# Altium project TL3572-EVM-A1.1-000-SCH-202609041404.PrjPcb (part 1 of 6)
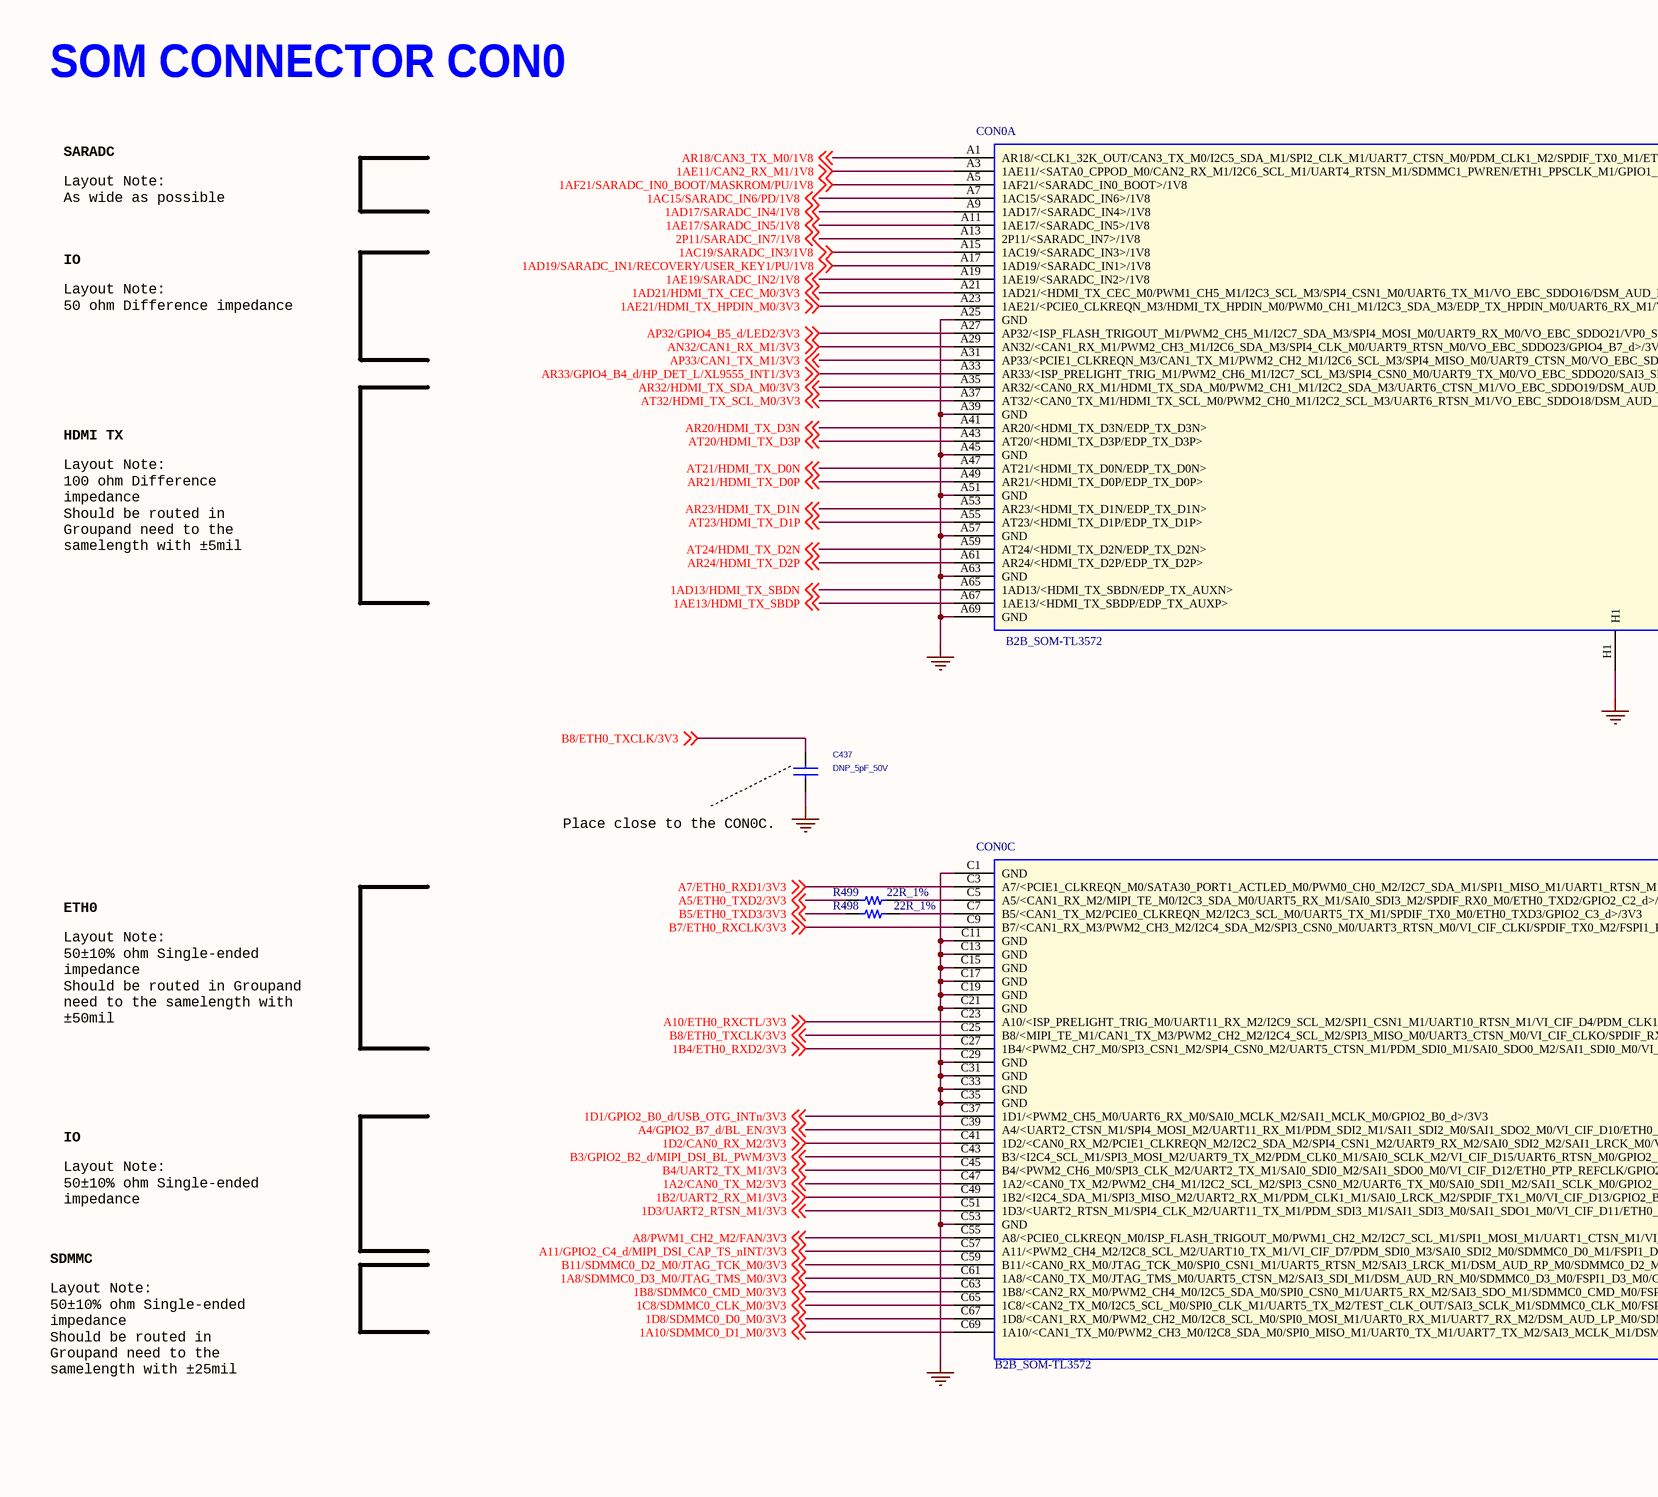
[diagram p0: P03_SOM CONNECTOR CON0.SchDoc, top left]
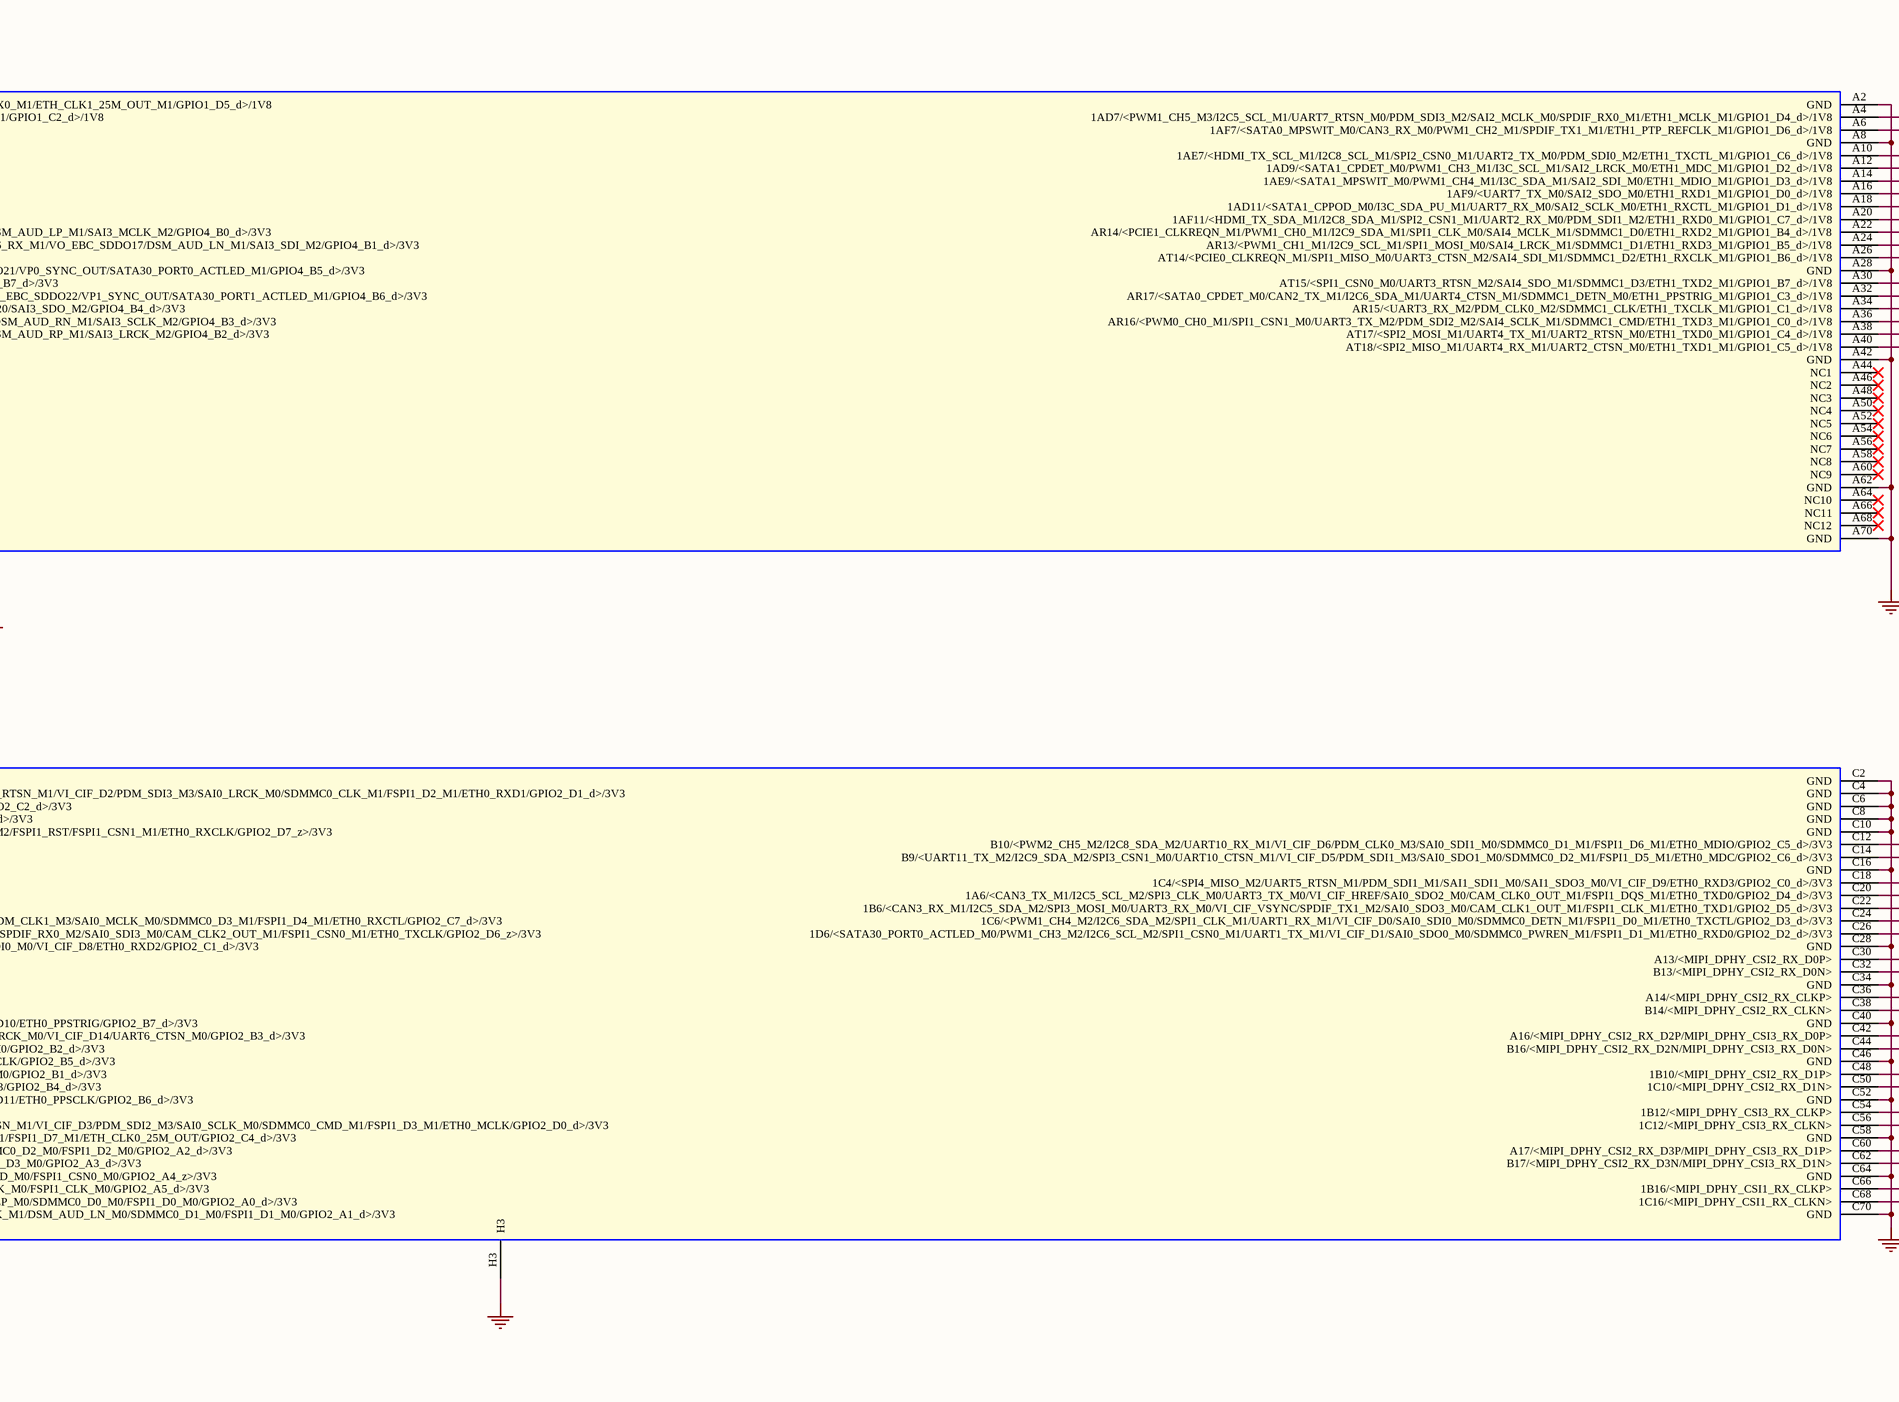
[diagram p1: P03_SOM CONNECTOR CON0.SchDoc, top middle]
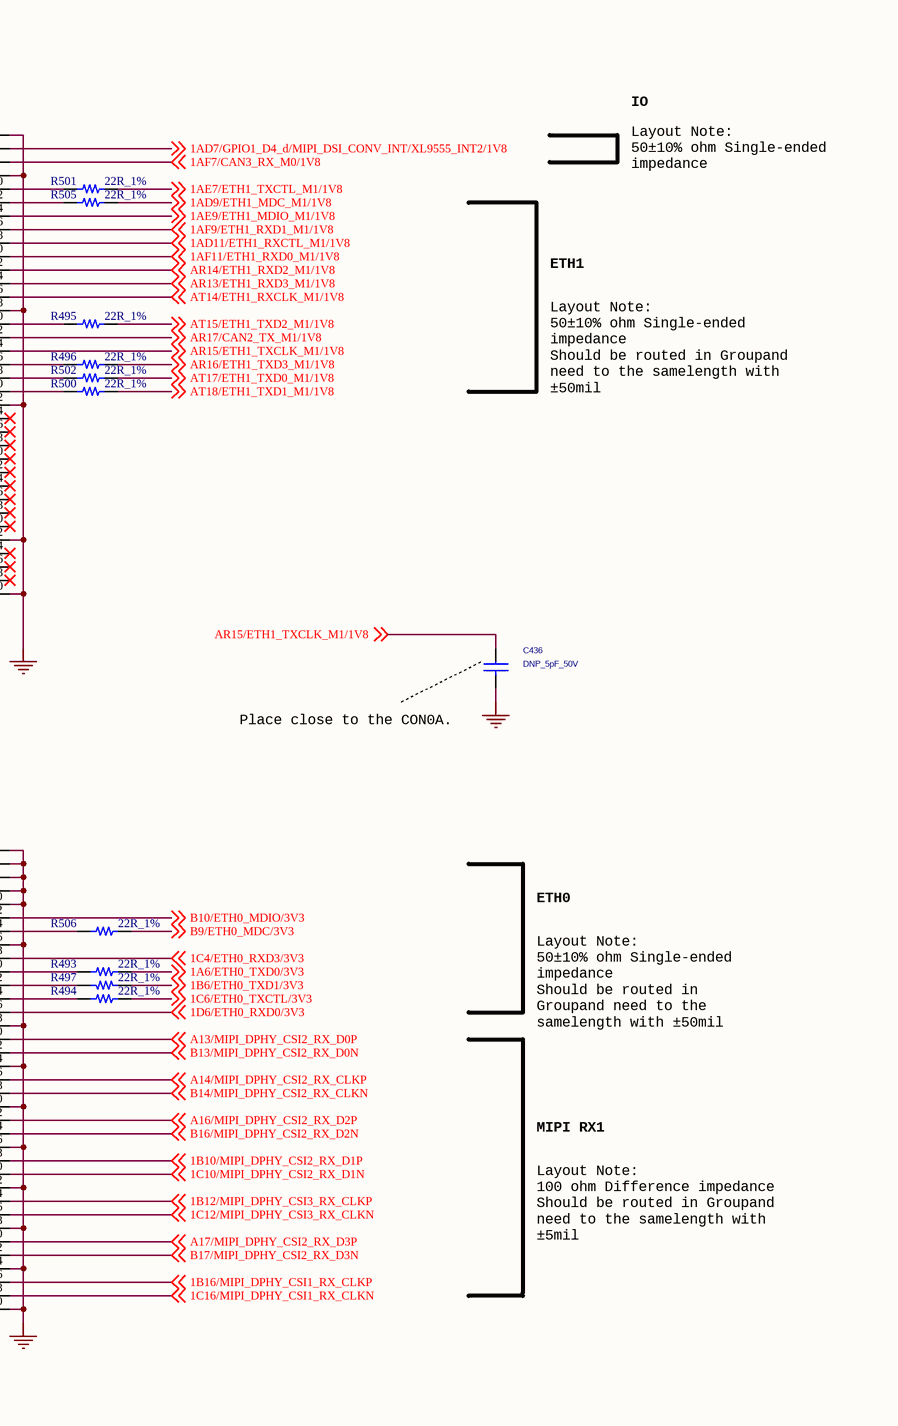
[diagram p2: P03_SOM CONNECTOR CON0.SchDoc, top right]
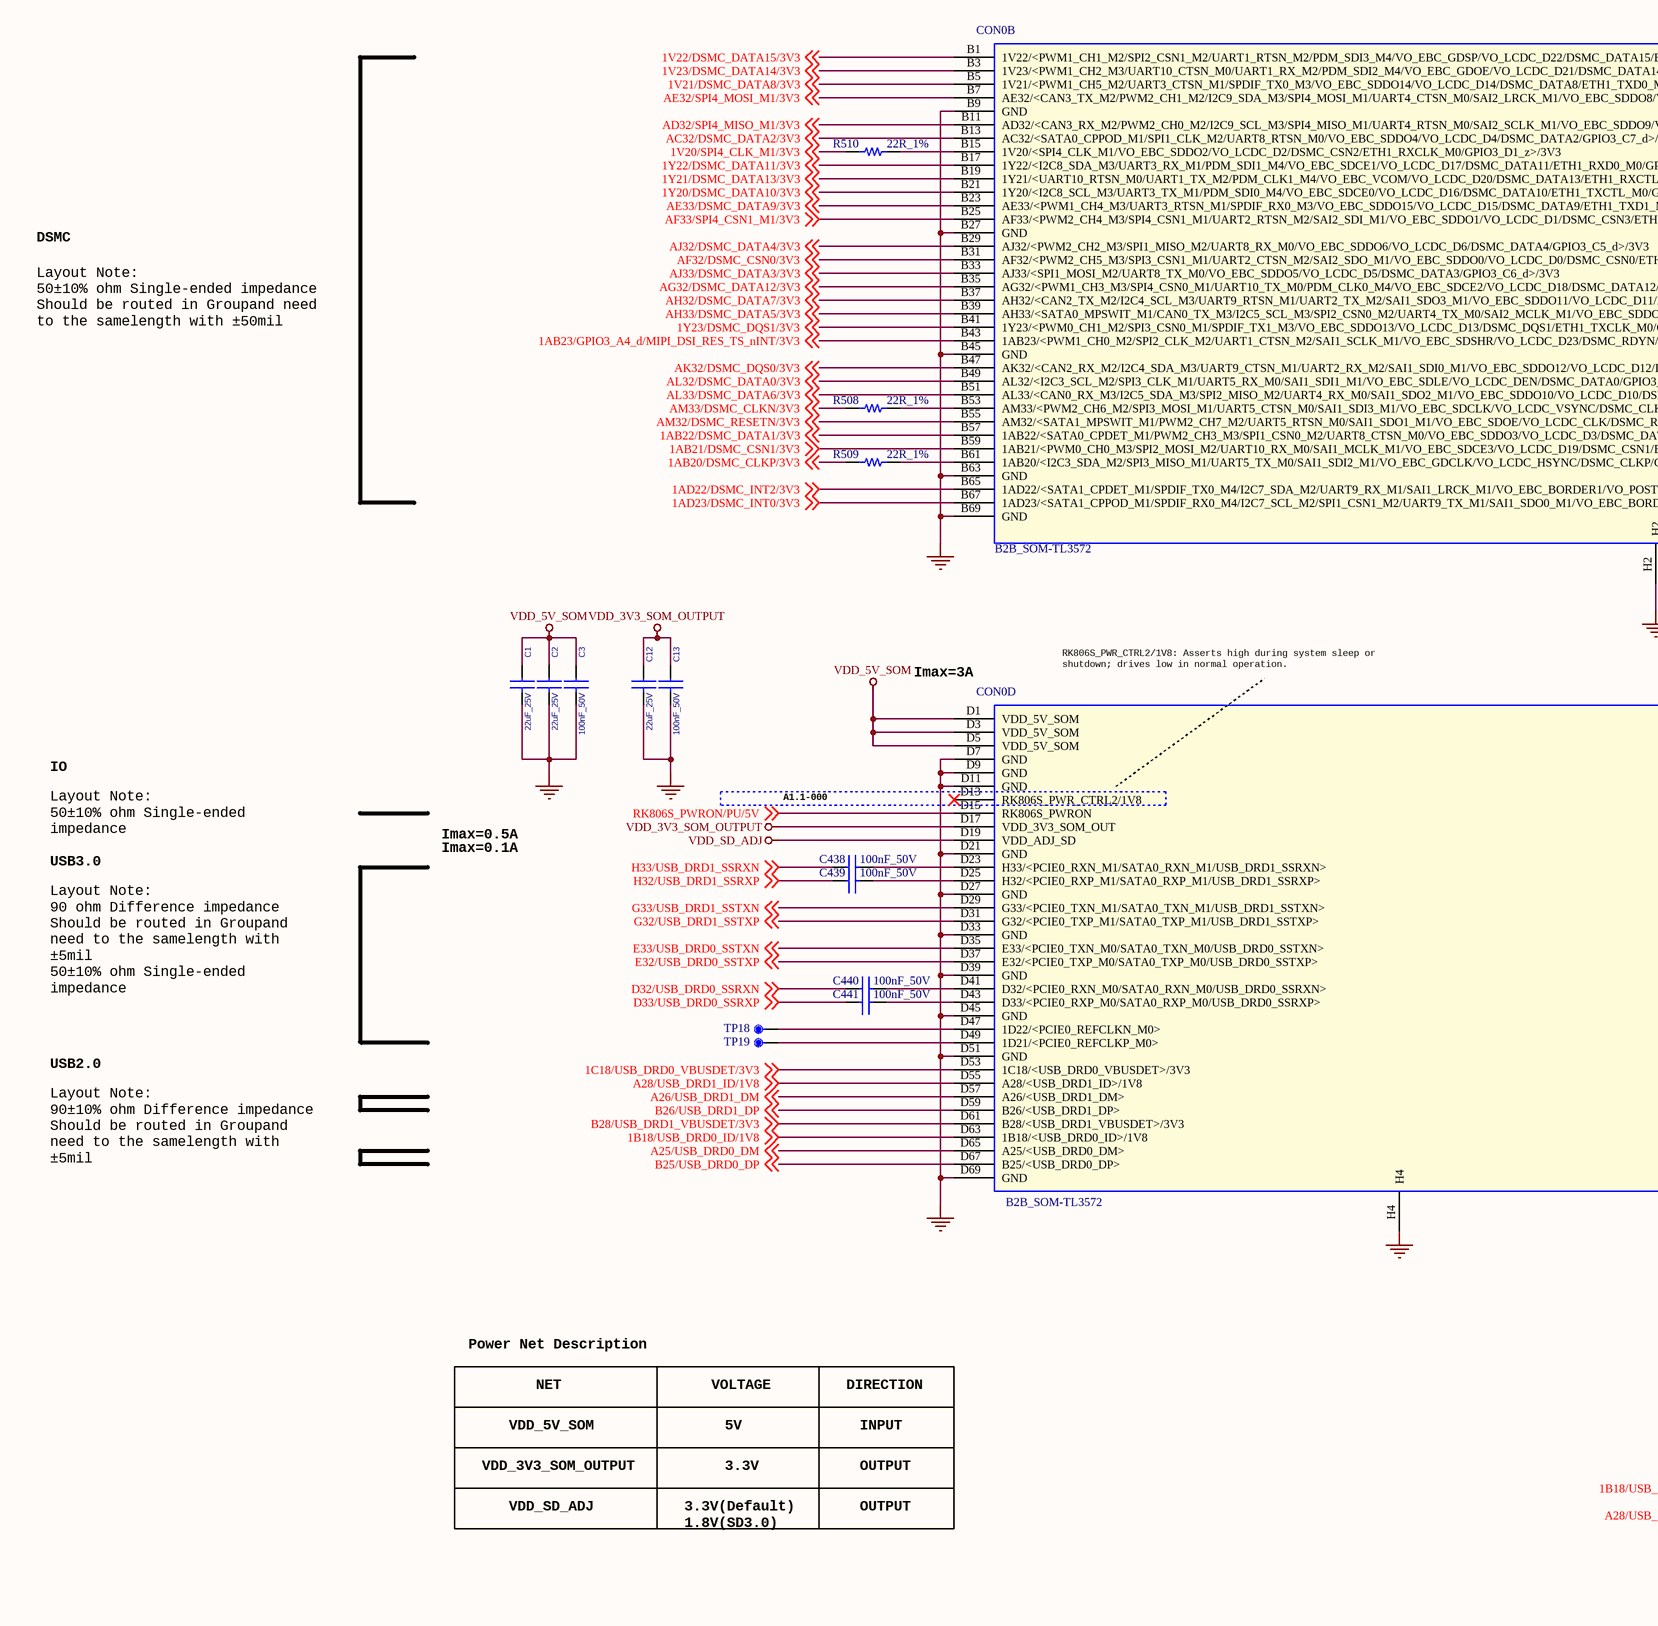
[diagram p3: P03_SOM CONNECTOR CON0.SchDoc, bottom left]
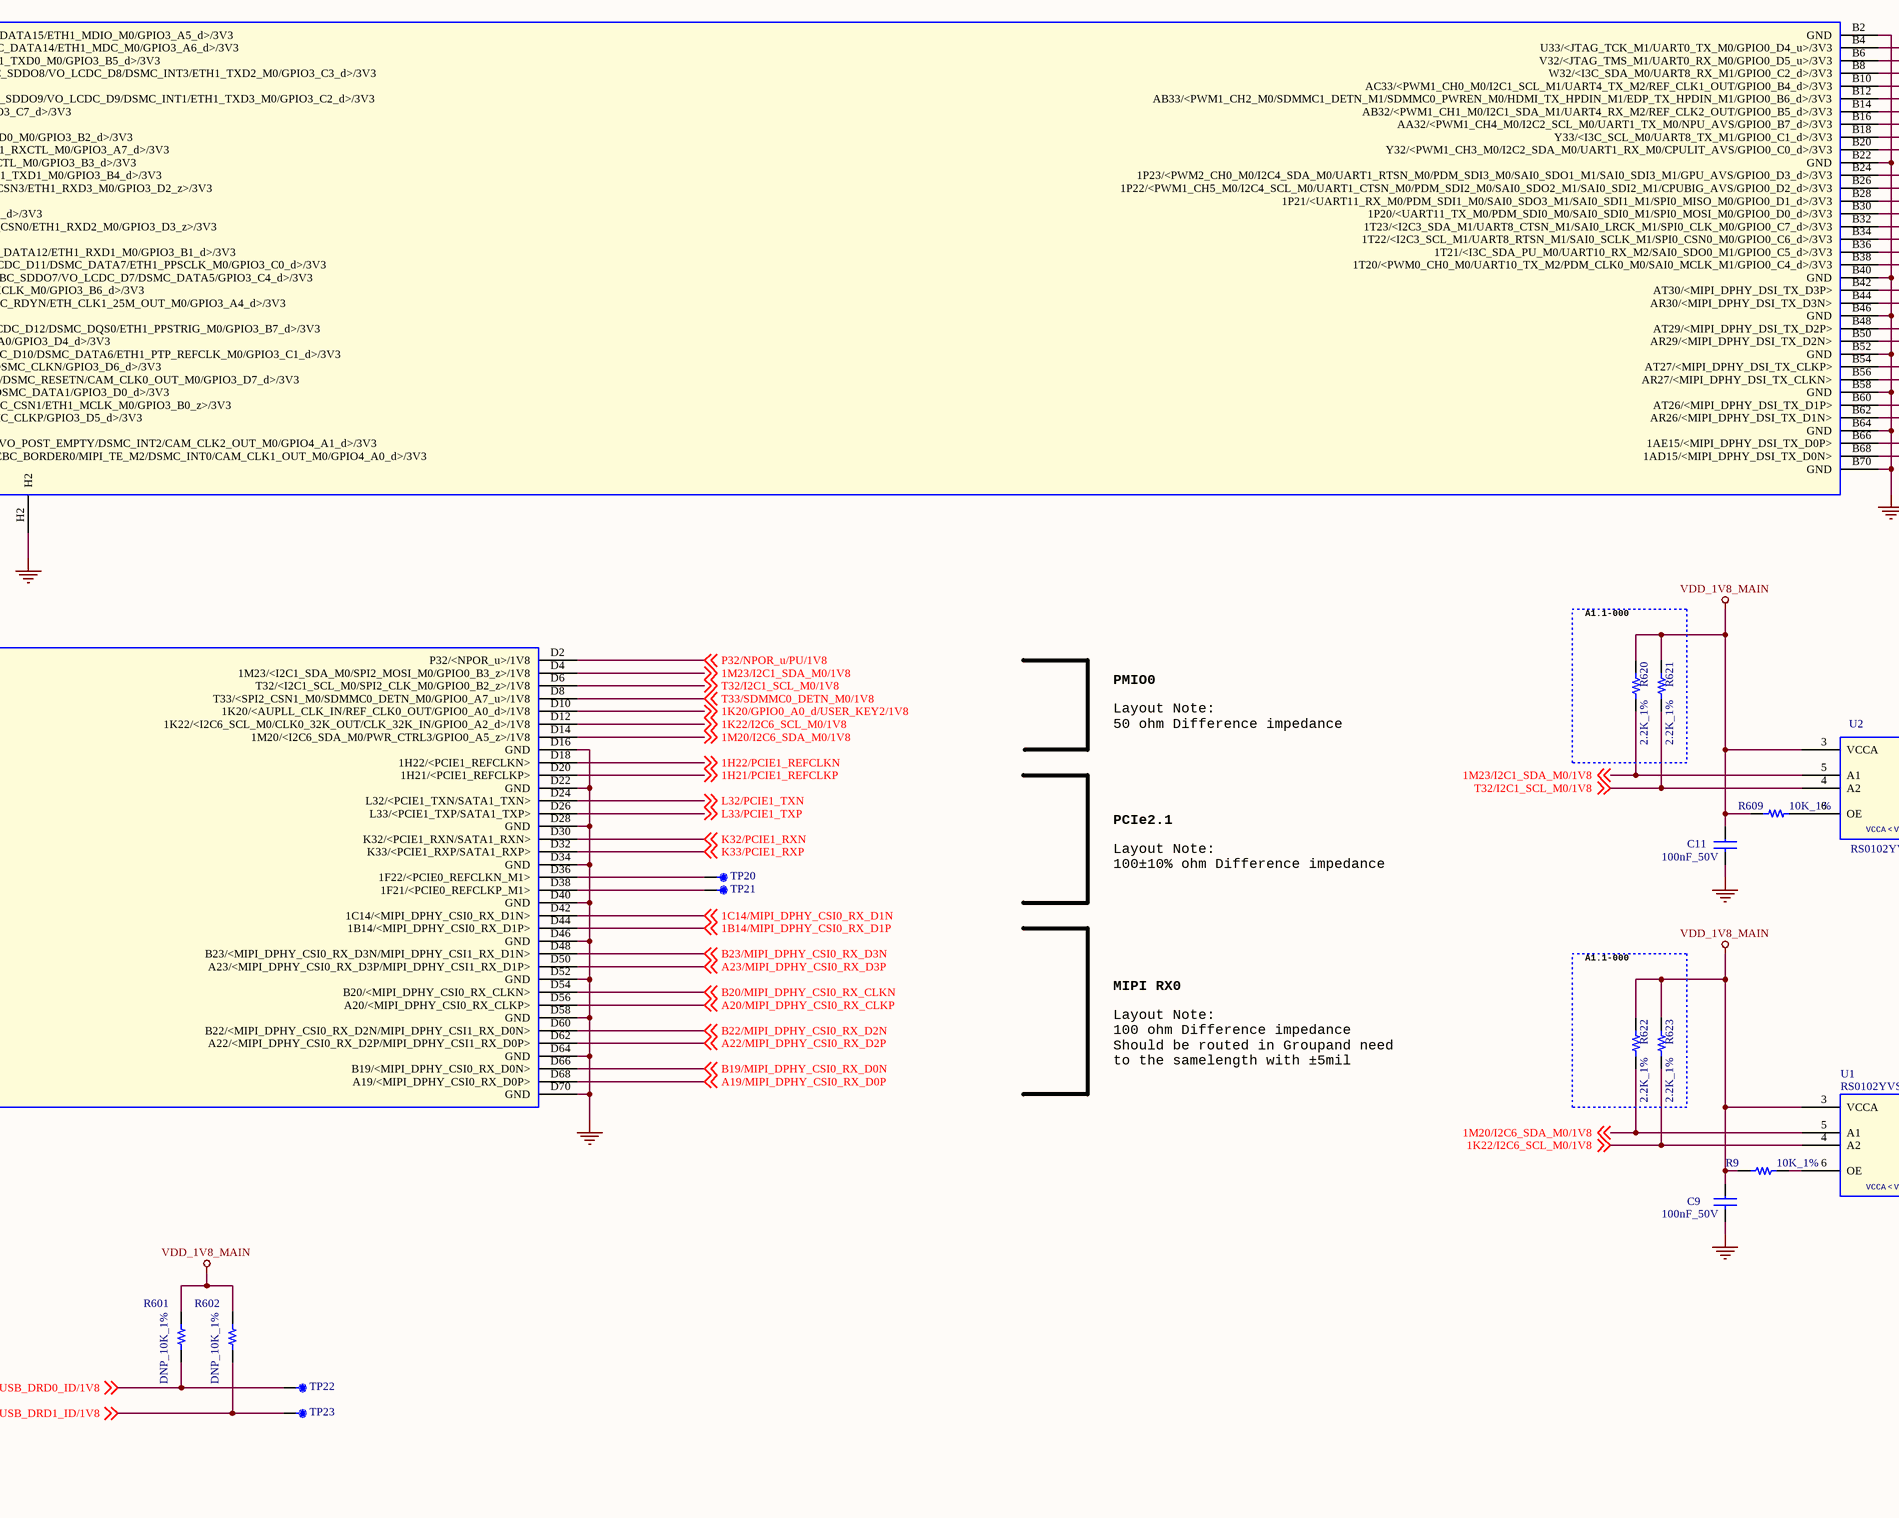
[diagram p4: P03_SOM CONNECTOR CON0.SchDoc, bottom middle]
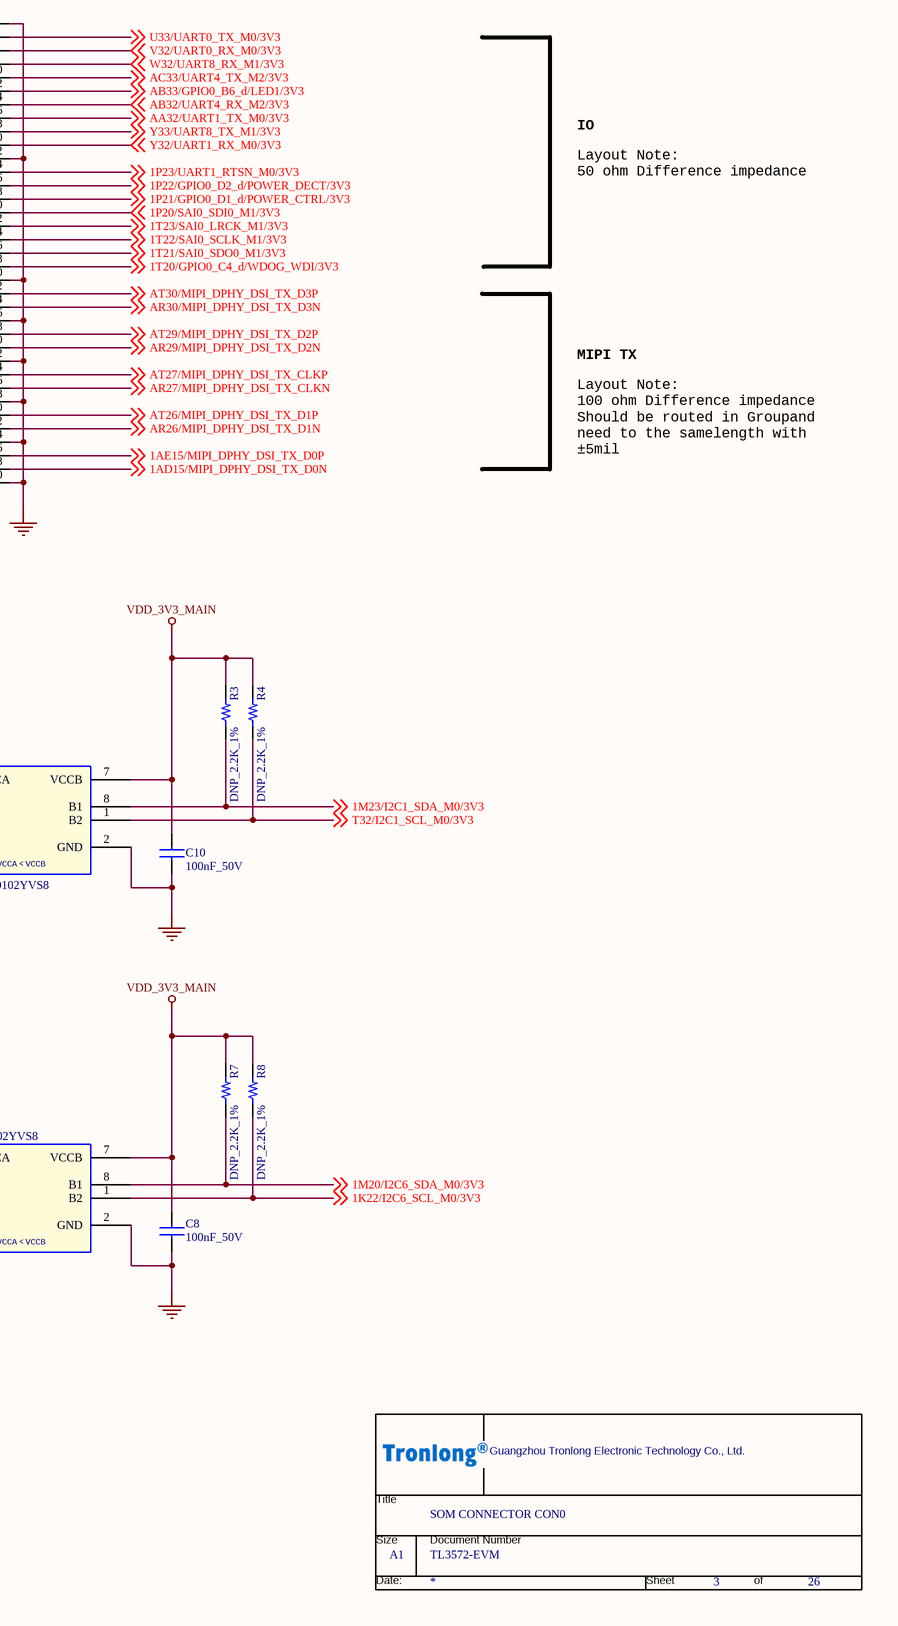
[diagram p5: P03_SOM CONNECTOR CON0.SchDoc, bottom right]
7 sheets, 429 parts. Net scope: global (net labels, ports and power ports of the same name join across sheets).
Sheets:
  P03_SOM CONNECTOR CON0.SchDoc
  P04_POWER01.SchDoc
  P05_POWER02.SchDoc
  P08_KEY_BOOT SET.SchDoc
  P13_ETH1 RGMII.SchDoc
  P19_M.2 KEY M SSD_WI-FI_BT.SchDoc
  P21_HDMI OUT.SchDoc

## Sheet P03_SOM CONNECTOR CON0.SchDoc
size 840 x 594 mm

### Parts
(Parts that share a designator on the sheet are numbered #1, #2 ... from top to bottom, then left to right.)
*#1  Doc: TL3572-EVM  Title: SOM CONNECTOR CON0  OrgName: Guangzhou Tronlong Electronic Technology Co., Ltd.  Page Size: A1  Page Number: 3  Page Count: 26  (hidden comment: Tronlong_TITTLE_20211115)  (graphical)
C1  22uF_25V  [C0805]
C2  22uF_25V  [C0805]
C3  100nF_50V  [C0402]
C8  100nF_50V  [C0402]
C9  100nF_50V  [C0402]
C10  100nF_50V  [C0402]
C11  100nF_50V  [C0402]
C12  22uF_25V  [C0805]
C13  100nF_50V  [C0402]
C436  DNP_5pF_50V  [C0402]
C437  DNP_5pF_50V  [C0402]
C438  100nF_50V  [C0402]
C439  100nF_50V  [C0402]
C440  100nF_50V  [C0402]
C441  100nF_50V  [C0402]
CON0  B2B_SOM-TL3572  [B2B_SOM-TL3572]  (parts A,B,C,D of 4)
R3  DNP_2.2K_1%  [R0402]
R4  DNP_2.2K_1%  [R0402]
R7  DNP_2.2K_1%  [R0402]
R8  DNP_2.2K_1%  [R0402]
R9  10K_1%  [R0402]
R493  22R_1%  [R0402]
R494  22R_1%  [R0402]
R495  22R_1%  [R0402]
R496  22R_1%  [R0402]
R497  22R_1%  [R0402]
R498  22R_1%  [R0402]
R499  22R_1%  [R0402]
R500  22R_1%  [R0402]
R501  22R_1%  [R0402]
R502  22R_1%  [R0402]
R505  22R_1%  [R0402]
R506  22R_1%  [R0402]
R508  22R_1%  [R0402]
R509  22R_1%  [R0402]
R510  22R_1%  [R0402]
R601  DNP_10K_1%  [R0402]
R602  DNP_10K_1%  [R0402]
R609  10K_1%  [R0402]
R620  2.2K_1%  [R0402]
R621  2.2K_1%  [R0402]
R622  2.2K_1%  [R0402]
R623  2.2K_1%  [R0402]
TP18  SMT TP  [TP30]  (value not drawn)
TP19  SMT TP  [TP30]  (value not drawn)
TP20  SMT TP  [TP30]  (value not drawn)
TP21  SMT TP  [TP30]  (value not drawn)
TP22  SMT TP  [TP30]  (value not drawn)
TP23  SMT TP  [TP30]  (value not drawn)
U1  RS0102YVS8  [SOP8-20-91]
U2  RS0102YVS8  [SOP8-20-91]

### Blocks framed on the sheet
A1.1-000: R620 R621
A1.1-000: R622 R623

### Nets
GND: C1.2 C2.2 C3.2 C8.2 C9.2 C10.2 C11.2 C12.2 C13.2 C436.2 C437.2 CON0.A2(GND) CON0.A8(GND) CON0.A25(GND) CON0.A28(GND) CON0.A39(GND) CON0.A42(GND) CON0.A45(GND) CON0.A51(GND) CON0.A57(GND) CON0.A62(GND) CON0.A63(GND) CON0.A69(GND) CON0.A70(GND) CON0.B2(GND) CON0.B9(GND) CON0.B22(GND) CON0.B27(GND) CON0.B40(GND) CON0.B45(GND) CON0.B46(GND) CON0.B52(GND) CON0.B58(GND) CON0.B63(GND) CON0.B64(GND) CON0.B69(GND) CON0.B70(GND) CON0.C1(GND) CON0.C2(GND) CON0.C4(GND) CON0.C6(GND) CON0.C8(GND) CON0.C10(GND) CON0.C11(GND) CON0.C13(GND) CON0.C15(GND) CON0.C16(GND) CON0.C17(GND) CON0.C19(GND) CON0.C21(GND) CON0.C28(GND) CON0.C29(GND) CON0.C31(GND) CON0.C33(GND) CON0.C34(GND) CON0.C35(GND) CON0.C40(GND) CON0.C46(GND) CON0.C52(GND) CON0.C53(GND) CON0.C58(GND) CON0.C64(GND) CON0.C70(GND) CON0.D7(GND) CON0.D9(GND) CON0.D11(GND) CON0.D16(GND) CON0.D21(GND) CON0.D22(GND) CON0.D27(GND) CON0.D28(GND) CON0.D33(GND) CON0.D34(GND) CON0.D39(GND) CON0.D40(GND) CON0.D45(GND) CON0.D46(GND) CON0.D51(GND) CON0.D52(GND) CON0.D58(GND) CON0.D64(GND) CON0.D69(GND) CON0.D70(GND) CON0.H1 CON0.H2 CON0.H3 CON0.H4 U1.2(GND) U2.2(GND)
VDD_1V8_MAIN: C9.1 C11.1 R9.1 R601.2 R602.2 R609.1 R620.1 R621.1 R622.1 R623.1 U1.3(VCCA) U2.3(VCCA)
VDD_3V3_MAIN: C8.1 C10.1 R3.1 R4.1 R7.1 R8.1 U1.7(VCCB) U2.7(VCCB)
VDD_3V3_SOM_OUTPUT: C12.1 C13.1 CON0.D17(VDD_3V3_SOM_OUT)
VDD_5V_SOM: C1.1 C2.1 C3.1 CON0.D1(VDD_5V_SOM) CON0.D3(VDD_5V_SOM) CON0.D5(VDD_5V_SOM)
VDD_SD_ADJ: CON0.D19(VDD_ADJ_SD)
1A2/CAN0_TX_M2/3V3: CON0.C47(1A2/<CAN0_TX_M2/PWM2_CH4_M1/I2C2_SCL_M2/SPI3_CSN0_M2/UART6_TX_M0/SAI0_SDI1_M2/SAI1_SCLK_M0/GPIO2_B1_d>/3V3) ; off-sheet 1A2/CAN0_TX_M2/3V3
1A6/ETH0_TXD0/3V3: R493.2 ; off-sheet 1A6/ETH0_TXD0/3V3
1A8/SDMMC0_D3_M0/JTAG_TMS_M0/3V3: CON0.C61(1A8/<CAN0_TX_M0/JTAG_TMS_M0/UART5_CTSN_M2/SAI3_SDI_M1/DSM_AUD_RN_M0/SDMMC0_D3_M0/FSPI1_D3_M0/GPIO2_A3_d>/3V3) ; off-sheet 1A8/SDMMC0_D3_M0/JTAG_TMS_M0/3V3
1A10/SDMMC0_D1_M0/3V3: CON0.C69(1A10/<CAN1_TX_M0/PWM2_CH3_M0/I2C8_SDA_M0/SPI0_MISO_M1/UART0_TX_M1/UART7_TX_M2/SAI3_MCLK_M1/DSM_AUD_LN_M0/SDMMC0_D1_M0/FSPI1_D1_M0/GPIO2_A1_d>/3V3) ; off-sheet 1A10/SDMMC0_D1_M0/3V3
1AB20/DSMC_CLKP/3V3: R509.1 ; off-sheet 1AB20/DSMC_CLKP/3V3
1AB21/DSMC_CSN1/3V3: CON0.B59(1AB21/<PWM0_CH0_M3/SPI2_MOSI_M2/UART10_RX_M0/SAI1_MCLK_M1/VO_EBC_SDCE3/VO_LCDC_D19/DSMC_CSN1/ETH1_MCLK_M0/GPIO3_B0_z>/3V3) ; off-sheet 1AB21/DSMC_CSN1/3V3
1AB22/DSMC_DATA1/3V3: CON0.B57(1AB22/<SATA0_CPDET_M1/PWM2_CH3_M3/SPI1_CSN0_M2/UART8_CTSN_M0/VO_EBC_SDDO3/VO_LCDC_D3/DSMC_DATA1/GPIO3_D0_d>/3V3) ; off-sheet 1AB22/DSMC_DATA1/3V3
1AB23/GPIO3_A4_d/MIPI_DSI_RES_TS_nINT/3V3: CON0.B43(1AB23/<PWM1_CH0_M2/SPI2_CLK_M2/UART1_CTSN_M2/SAI1_SCLK_M1/VO_EBC_SDSHR/VO_LCDC_D23/DSMC_RDYN/ETH_CLK1_25M_OUT_M0/GPIO3_A4_d>/3V3) ; off-sheet 1AB23/GPIO3_A4_d/MIPI_DSI_RES_TS_nINT/3V3
1AC15/SARADC_IN6/PD/1V8: CON0.A7(1AC15/<SARADC_IN6>/1V8) ; off-sheet 1AC15/SARADC_IN6/PD/1V8
1AC19/SARADC_IN3/1V8: CON0.A15(1AC19/<SARADC_IN3>/1V8) ; off-sheet 1AC19/SARADC_IN3/1V8
1AD7/GPIO1_D4_d/MIPI_DSI_CONV_INT/XL9555_INT2/1V8: CON0.A4(1AD7/<PWM1_CH5_M3/I2C5_SCL_M1/UART7_RTSN_M0/PDM_SDI3_M2/SAI2_MCLK_M0/SPDIF_RX0_M1/ETH1_MCLK_M1/GPIO1_D4_d>/1V8) ; off-sheet 1AD7/GPIO1_D4_d/MIPI_DSI_CONV_INT/XL9555_INT2/1V8
1AD9/ETH1_MDC_M1/1V8: R505.2 ; off-sheet 1AD9/ETH1_MDC_M1/1V8
1AD11/ETH1_RXCTL_M1/1V8: CON0.A18(1AD11/<SATA1_CPPOD_M0/I3C_SDA_PU_M1/UART7_RX_M0/SAI2_SCLK_M0/ETH1_RXCTL_M1/GPIO1_D1_d>/1V8) ; off-sheet 1AD11/ETH1_RXCTL_M1/1V8
1AD13/HDMI_TX_SBDN: CON0.A65(1AD13/<HDMI_TX_SBDN/EDP_TX_AUXN>) ; off-sheet 1AD13/HDMI_TX_SBDN
1AD15/MIPI_DPHY_DSI_TX_D0N: CON0.B68(1AD15/<MIPI_DPHY_DSI_TX_D0N>) ; off-sheet 1AD15/MIPI_DPHY_DSI_TX_D0N
1AD17/SARADC_IN4/1V8: CON0.A9(1AD17/<SARADC_IN4>/1V8) ; off-sheet 1AD17/SARADC_IN4/1V8
1AD19/SARADC_IN1/RECOVERY/USER_KEY1/PU/1V8: CON0.A17(1AD19/<SARADC_IN1>/1V8) ; off-sheet 1AD19/SARADC_IN1/RECOVERY/USER_KEY1/PU/1V8
1AD21/HDMI_TX_CEC_M0/3V3: CON0.A21(1AD21/<HDMI_TX_CEC_M0/PWM1_CH5_M1/I2C3_SCL_M3/SPI4_CSN1_M0/UART6_TX_M1/VO_EBC_SDDO16/DSM_AUD_LP_M1/SAI3_MCLK_M2/GPIO4_B0_d>/3V3) ; off-sheet 1AD21/HDMI_TX_CEC_M0/3V3
1AD22/DSMC_INT2/3V3: CON0.B65(1AD22/<SATA1_CPDET_M1/SPDIF_TX0_M4/I2C7_SDA_M2/UART9_RX_M1/SAI1_LRCK_M1/VO_EBC_BORDER1/VO_POST_EMPTY/DSMC_INT2/CAM_CLK2_OUT_M0/GPIO4_A1_d>/3V3) ; off-sheet 1AD22/DSMC_INT2/3V3
1AD23/DSMC_INT0/3V3: CON0.B67(1AD23/<SATA1_CPPOD_M1/SPDIF_RX0_M4/I2C7_SCL_M2/SPI1_CSN1_M2/UART9_TX_M1/SAI1_SDO0_M1/VO_EBC_BORDER0/MIPI_TE_M2/DSMC_INT0/CAM_CLK1_OUT_M0/GPIO4_A0_d>/3V3) ; off-sheet 1AD23/DSMC_INT0/3V3
1AE7/ETH1_TXCTL_M1/1V8: R501.2 ; off-sheet 1AE7/ETH1_TXCTL_M1/1V8
1AE9/ETH1_MDIO_M1/1V8: CON0.A14(1AE9/<SATA1_MPSWIT_M0/PWM1_CH4_M1/I3C_SDA_M1/SAI2_SDI_M0/ETH1_MDIO_M1/GPIO1_D3_d>/1V8) ; off-sheet 1AE9/ETH1_MDIO_M1/1V8
1AE11/CAN2_RX_M1/1V8: CON0.A3(1AE11/<SATA0_CPPOD_M0/CAN2_RX_M1/I2C6_SCL_M1/UART4_RTSN_M1/SDMMC1_PWREN/ETH1_PPSCLK_M1/GPIO1_C2_d>/1V8) ; off-sheet 1AE11/CAN2_RX_M1/1V8
1AE13/HDMI_TX_SBDP: CON0.A67(1AE13/<HDMI_TX_SBDP/EDP_TX_AUXP>) ; off-sheet 1AE13/HDMI_TX_SBDP
1AE15/MIPI_DPHY_DSI_TX_D0P: CON0.B66(1AE15/<MIPI_DPHY_DSI_TX_D0P>) ; off-sheet 1AE15/MIPI_DPHY_DSI_TX_D0P
1AE17/SARADC_IN5/1V8: CON0.A11(1AE17/<SARADC_IN5>/1V8) ; off-sheet 1AE17/SARADC_IN5/1V8
1AE19/SARADC_IN2/1V8: CON0.A19(1AE19/<SARADC_IN2>/1V8) ; off-sheet 1AE19/SARADC_IN2/1V8
1AE21/HDMI_TX_HPDIN_M0/3V3: CON0.A23(1AE21/<PCIE0_CLKREQN_M3/HDMI_TX_HPDIN_M0/PWM0_CH1_M1/I2C3_SDA_M3/EDP_TX_HPDIN_M0/UART6_RX_M1/VO_EBC_SDDO17/DSM_AUD_LN_M1/SAI3_SDI_M2/GPIO4_B1_d>/3V3) ; off-sheet 1AE21/HDMI_TX_HPDIN_M0/3V3
1AF7/CAN3_RX_M0/1V8: CON0.A6(1AF7/<SATA0_MPSWIT_M0/CAN3_RX_M0/PWM1_CH2_M1/SPDIF_TX1_M1/ETH1_PTP_REFCLK_M1/GPIO1_D6_d>/1V8) ; off-sheet 1AF7/CAN3_RX_M0/1V8
1AF9/ETH1_RXD1_M1/1V8: CON0.A16(1AF9/<UART7_TX_M0/SAI2_SDO_M0/ETH1_RXD1_M1/GPIO1_D0_d>/1V8) ; off-sheet 1AF9/ETH1_RXD1_M1/1V8
1AF11/ETH1_RXD0_M1/1V8: CON0.A20(1AF11/<HDMI_TX_SDA_M1/I2C8_SDA_M1/SPI2_CSN1_M1/UART2_RX_M0/PDM_SDI1_M2/ETH1_RXD0_M1/GPIO1_C7_d>/1V8) ; off-sheet 1AF11/ETH1_RXD0_M1/1V8
1AF21/SARADC_IN0_BOOT/MASKROM/PU/1V8: CON0.A5(1AF21/<SARADC_IN0_BOOT>/1V8) ; off-sheet 1AF21/SARADC_IN0_BOOT/MASKROM/PU/1V8
1B2/UART2_RX_M1/3V3: CON0.C49(1B2/<I2C4_SDA_M1/SPI3_MISO_M2/UART2_RX_M1/PDM_CLK1_M1/SAI0_LRCK_M2/SPDIF_TX1_M0/VI_CIF_D13/GPIO2_B4_d>/3V3) ; off-sheet 1B2/UART2_RX_M1/3V3
1B4/ETH0_RXD2/3V3: CON0.C27(1B4/<PWM2_CH7_M0/SPI3_CSN1_M2/SPI4_CSN0_M2/UART5_CTSN_M1/PDM_SDI0_M1/SAI0_SDO0_M2/SAI1_SDI0_M0/VI_CIF_D8/ETH0_RXD2/GPIO2_C1_d>/3V3) ; off-sheet 1B4/ETH0_RXD2/3V3
1B6/ETH0_TXD1/3V3: R497.1 ; off-sheet 1B6/ETH0_TXD1/3V3
1B8/SDMMC0_CMD_M0/3V3: CON0.C63(1B8/<CAN2_RX_M0/PWM2_CH4_M0/I2C5_SDA_M0/SPI0_CSN0_M1/UART5_RX_M2/SAI3_SDO_M1/SDMMC0_CMD_M0/FSPI1_CSN0_M0/GPIO2_A4_z>/3V3) ; off-sheet 1B8/SDMMC0_CMD_M0/3V3
1B10/MIPI_DPHY_CSI2_RX_D1P: CON0.C48(1B10/<MIPI_DPHY_CSI2_RX_D1P>) ; off-sheet 1B10/MIPI_DPHY_CSI2_RX_D1P
1B12/MIPI_DPHY_CSI3_RX_CLKP: CON0.C54(1B12/<MIPI_DPHY_CSI3_RX_CLKP>) ; off-sheet 1B12/MIPI_DPHY_CSI3_RX_CLKP
1B14/MIPI_DPHY_CSI0_RX_D1P: CON0.D44(1B14/<MIPI_DPHY_CSI0_RX_D1P>) ; off-sheet 1B14/MIPI_DPHY_CSI0_RX_D1P
1B16/MIPI_DPHY_CSI1_RX_CLKP: CON0.C66(1B16/<MIPI_DPHY_CSI1_RX_CLKP>) ; off-sheet 1B16/MIPI_DPHY_CSI1_RX_CLKP
1B18/USB_DRD0_ID/1V8: CON0.D63(1B18/<USB_DRD0_ID>/1V8) R601.1 TP22.1 ; off-sheet 1B18/USB_DRD0_ID/1V8
1C4/ETH0_RXD3/3V3: CON0.C18(1C4/<SPI4_MISO_M2/UART5_RTSN_M1/PDM_SDI1_M1/SAI1_SDI1_M0/SAI1_SDO3_M0/VI_CIF_D9/ETH0_RXD3/GPIO2_C0_d>/3V3) ; off-sheet 1C4/ETH0_RXD3/3V3
1C6/ETH0_TXCTL/3V3: R494.2 ; off-sheet 1C6/ETH0_TXCTL/3V3
1C8/SDMMC0_CLK_M0/3V3: CON0.C65(1C8/<CAN2_TX_M0/I2C5_SCL_M0/SPI0_CLK_M1/UART5_TX_M2/TEST_CLK_OUT/SAI3_SCLK_M1/SDMMC0_CLK_M0/FSPI1_CLK_M0/GPIO2_A5_d>/3V3) ; off-sheet 1C8/SDMMC0_CLK_M0/3V3
1C10/MIPI_DPHY_CSI2_RX_D1N: CON0.C50(1C10/<MIPI_DPHY_CSI2_RX_D1N>) ; off-sheet 1C10/MIPI_DPHY_CSI2_RX_D1N
1C12/MIPI_DPHY_CSI3_RX_CLKN: CON0.C56(1C12/<MIPI_DPHY_CSI3_RX_CLKN>) ; off-sheet 1C12/MIPI_DPHY_CSI3_RX_CLKN
1C14/MIPI_DPHY_CSI0_RX_D1N: CON0.D42(1C14/<MIPI_DPHY_CSI0_RX_D1N>) ; off-sheet 1C14/MIPI_DPHY_CSI0_RX_D1N
1C16/MIPI_DPHY_CSI1_RX_CLKN: CON0.C68(1C16/<MIPI_DPHY_CSI1_RX_CLKN>) ; off-sheet 1C16/MIPI_DPHY_CSI1_RX_CLKN
1C18/USB_DRD0_VBUSDET/3V3: CON0.D53(1C18/<USB_DRD0_VBUSDET>/3V3) ; off-sheet 1C18/USB_DRD0_VBUSDET/3V3
1D1/GPIO2_B0_d/USB_OTG_INTn/3V3: CON0.C37(1D1/<PWM2_CH5_M0/UART6_RX_M0/SAI0_MCLK_M2/SAI1_MCLK_M0/GPIO2_B0_d>/3V3) ; off-sheet 1D1/GPIO2_B0_d/USB_OTG_INTn/3V3
1D2/CAN0_RX_M2/3V3: CON0.C41(1D2/<CAN0_RX_M2/PCIE1_CLKREQN_M2/I2C2_SDA_M2/SPI4_CSN1_M2/UART9_RX_M2/SAI0_SDI2_M2/SAI1_LRCK_M0/VI_CIF_D14/UART6_CTSN_M0/GPIO2_B3_d>/3V3) ; off-sheet 1D2/CAN0_RX_M2/3V3
1D3/UART2_RTSN_M1/3V3: CON0.C51(1D3/<UART2_RTSN_M1/SPI4_CLK_M2/UART11_TX_M1/PDM_SDI3_M1/SAI1_SDI3_M0/SAI1_SDO1_M0/VI_CIF_D11/ETH0_PPSCLK/GPIO2_B6_d>/3V3) ; off-sheet 1D3/UART2_RTSN_M1/3V3
1D6/ETH0_RXD0/3V3: CON0.C26(1D6/<SATA30_PORT0_ACTLED_M0/PWM1_CH3_M2/I2C6_SCL_M2/SPI1_CSN0_M1/UART1_TX_M1/VI_CIF_D1/SAI0_SDO0_M0/SDMMC0_PWREN_M1/FSPI1_D1_M1/ETH0_RXD0/GPIO2_D2_d>/3V3) ; off-sheet 1D6/ETH0_RXD0/3V3
1D8/SDMMC0_D0_M0/3V3: CON0.C67(1D8/<CAN1_RX_M0/PWM2_CH2_M0/I2C8_SCL_M0/SPI0_MOSI_M1/UART0_RX_M1/UART7_RX_M2/DSM_AUD_LP_M0/SDMMC0_D0_M0/FSPI1_D0_M0/GPIO2_A0_d>/3V3) ; off-sheet 1D8/SDMMC0_D0_M0/3V3
1H21/PCIE1_REFCLKP: CON0.D20(1H21/<PCIE1_REFCLKP>) ; off-sheet 1H21/PCIE1_REFCLKP
1H22/PCIE1_REFCLKN: CON0.D18(1H22/<PCIE1_REFCLKN>) ; off-sheet 1H22/PCIE1_REFCLKN
1K20/GPIO0_A0_d/USER_KEY2/1V8: CON0.D10(1K20/<AUPLL_CLK_IN/REF_CLK0_OUT/GPIO0_A0_d>/1V8) ; off-sheet 1K20/GPIO0_A0_d/USER_KEY2/1V8
1K22/I2C6_SCL_M0/1V8: CON0.D12(1K22/<I2C6_SCL_M0/CLK0_32K_OUT/CLK_32K_IN/GPIO0_A2_d>/1V8) R623.2 U1.4(A2) ; off-sheet 1K22/I2C6_SCL_M0/1V8
1K22/I2C6_SCL_M0/3V3: R8.2 U1.1(B2) ; off-sheet 1K22/I2C6_SCL_M0/3V3
1M20/I2C6_SDA_M0/1V8: CON0.D14(1M20/<I2C6_SDA_M0/PWR_CTRL3/GPIO0_A5_z>/1V8) R622.2 U1.5(A1) ; off-sheet 1M20/I2C6_SDA_M0/1V8
1M20/I2C6_SDA_M0/3V3: R7.2 U1.8(B1) ; off-sheet 1M20/I2C6_SDA_M0/3V3
1M23/I2C1_SDA_M0/1V8: CON0.D4(1M23/<I2C1_SDA_M0/SPI2_MOSI_M0/GPIO0_B3_z>/1V8) R620.2 U2.5(A1) ; off-sheet 1M23/I2C1_SDA_M0/1V8
1M23/I2C1_SDA_M0/3V3: R3.2 U2.8(B1) ; off-sheet 1M23/I2C1_SDA_M0/3V3
1P20/SAI0_SDI0_M1/3V3: CON0.B30(1P20/<UART11_TX_M0/PDM_SDI0_M0/SAI0_SDI0_M1/SPI0_MOSI_M0/GPIO0_D0_d>/3V3) ; off-sheet 1P20/SAI0_SDI0_M1/3V3
1P21/GPIO0_D1_d/POWER_CTRL/3V3: CON0.B28(1P21/<UART11_RX_M0/PDM_SDI1_M0/SAI0_SDO3_M1/SAI0_SDI1_M1/SPI0_MISO_M0/GPIO0_D1_d>/3V3) ; off-sheet 1P21/GPIO0_D1_d/POWER_CTRL/3V3
1P22/GPIO0_D2_d/POWER_DECT/3V3: CON0.B26(1P22/<PWM1_CH5_M0/I2C4_SCL_M0/UART1_CTSN_M0/PDM_SDI2_M0/SAI0_SDO2_M1/SAI0_SDI2_M1/CPUBIG_AVS/GPIO0_D2_d>/3V3) ; off-sheet 1P22/GPIO0_D2_d/POWER_DECT/3V3
1P23/UART1_RTSN_M0/3V3: CON0.B24(1P23/<PWM2_CH0_M0/I2C4_SDA_M0/UART1_RTSN_M0/PDM_SDI3_M0/SAI0_SDO1_M1/SAI0_SDI3_M1/GPU_AVS/GPIO0_D3_d>/3V3) ; off-sheet 1P23/UART1_RTSN_M0/3V3
1T20/GPIO0_C4_d/WDOG_WDI/3V3: CON0.B38(1T20/<PWM0_CH0_M0/UART10_TX_M2/PDM_CLK0_M0/SAI0_MCLK_M1/GPIO0_C4_d>/3V3) ; off-sheet 1T20/GPIO0_C4_d/WDOG_WDI/3V3
1T21/SAI0_SDO0_M1/3V3: CON0.B36(1T21/<I3C_SDA_PU_M0/UART10_RX_M2/SAI0_SDO0_M1/GPIO0_C5_d>/3V3) ; off-sheet 1T21/SAI0_SDO0_M1/3V3
1T22/SAI0_SCLK_M1/3V3: CON0.B34(1T22/<I2C3_SCL_M1/UART8_RTSN_M1/SAI0_SCLK_M1/SPI0_CSN0_M0/GPIO0_C6_d>/3V3) ; off-sheet 1T22/SAI0_SCLK_M1/3V3
1T23/SAI0_LRCK_M1/3V3: CON0.B32(1T23/<I2C3_SDA_M1/UART8_CTSN_M1/SAI0_LRCK_M1/SPI0_CLK_M0/GPIO0_C7_d>/3V3) ; off-sheet 1T23/SAI0_LRCK_M1/3V3
1V20/SPI4_CLK_M1/3V3: R510.1 ; off-sheet 1V20/SPI4_CLK_M1/3V3
1V21/DSMC_DATA8/3V3: CON0.B5(1V21/<PWM1_CH5_M2/UART3_CTSN_M1/SPDIF_TX0_M3/VO_EBC_SDDO14/VO_LCDC_D14/DSMC_DATA8/ETH1_TXD0_M0/GPIO3_B5_d>/3V3) ; off-sheet 1V21/DSMC_DATA8/3V3
1V22/DSMC_DATA15/3V3: CON0.B1(1V22/<PWM1_CH1_M2/SPI2_CSN1_M2/UART1_RTSN_M2/PDM_SDI3_M4/VO_EBC_GDSP/VO_LCDC_D22/DSMC_DATA15/ETH1_MDIO_M0/GPIO3_A5_d>/3V3) ; off-sheet 1V22/DSMC_DATA15/3V3
1V23/DSMC_DATA14/3V3: CON0.B3(1V23/<PWM1_CH2_M3/UART10_CTSN_M0/UART1_RX_M2/PDM_SDI2_M4/VO_EBC_GDOE/VO_LCDC_D21/DSMC_DATA14/ETH1_MDC_M0/GPIO3_A6_d>/3V3) ; off-sheet 1V23/DSMC_DATA14/3V3
1Y20/DSMC_DATA10/3V3: CON0.B21(1Y20/<I2C8_SCL_M3/UART3_TX_M1/PDM_SDI0_M4/VO_EBC_SDCE0/VO_LCDC_D16/DSMC_DATA10/ETH1_TXCTL_M0/GPIO3_B3_d>/3V3) ; off-sheet 1Y20/DSMC_DATA10/3V3
1Y21/DSMC_DATA13/3V3: CON0.B19(1Y21/<UART10_RTSN_M0/UART1_TX_M2/PDM_CLK1_M4/VO_EBC_VCOM/VO_LCDC_D20/DSMC_DATA13/ETH1_RXCTL_M0/GPIO3_A7_d>/3V3) ; off-sheet 1Y21/DSMC_DATA13/3V3
1Y22/DSMC_DATA11/3V3: CON0.B17(1Y22/<I2C8_SDA_M3/UART3_RX_M1/PDM_SDI1_M4/VO_EBC_SDCE1/VO_LCDC_D17/DSMC_DATA11/ETH1_RXD0_M0/GPIO3_B2_d>/3V3) ; off-sheet 1Y22/DSMC_DATA11/3V3
1Y23/DSMC_DQS1/3V3: CON0.B41(1Y23/<PWM0_CH1_M2/SPI3_CSN0_M1/SPDIF_TX1_M3/VO_EBC_SDDO13/VO_LCDC_D13/DSMC_DQS1/ETH1_TXCLK_M0/GPIO3_B6_d>/3V3) ; off-sheet 1Y23/DSMC_DQS1/3V3
2P11/SARADC_IN7/1V8: CON0.A13(2P11/<SARADC_IN7>/1V8) ; off-sheet 2P11/SARADC_IN7/1V8
A4/GPIO2_B7_d/BL_EN/3V3: CON0.C39(A4/<UART2_CTSN_M1/SPI4_MOSI_M2/UART11_RX_M1/PDM_SDI2_M1/SAI1_SDI2_M0/SAI1_SDO2_M0/VI_CIF_D10/ETH0_PPSTRIG/GPIO2_B7_d>/3V3) ; off-sheet A4/GPIO2_B7_d/BL_EN/3V3
A5/ETH0_TXD2/3V3: R499.1 ; off-sheet A5/ETH0_TXD2/3V3
A7/ETH0_RXD1/3V3: CON0.C3(A7/<PCIE1_CLKREQN_M0/SATA30_PORT1_ACTLED_M0/PWM0_CH0_M2/I2C7_SDA_M1/SPI1_MISO_M1/UART1_RTSN_M1/VI_CIF_D2/PDM_SDI3_M3/SAI0_LRCK_M0/SDMMC0_CLK_M1/FSPI1_D2_M1/ETH0_RXD1/GPIO2_D1_d>/3V3) ; off-sheet A7/ETH0_RXD1/3V3
A8/PWM1_CH2_M2/FAN/3V3: CON0.C55(A8/<PCIE0_CLKREQN_M0/ISP_FLASH_TRIGOUT_M0/PWM1_CH2_M2/I2C7_SCL_M1/SPI1_MOSI_M1/UART1_CTSN_M1/VI_CIF_D3/PDM_SDI2_M3/SAI0_SCLK_M0/SDMMC0_CMD_M1/FSPI1_D3_M1/ETH0_MCLK/GPIO2_D0_d>/3V3) ; off-sheet A8/PWM1_CH2_M2/FAN/3V3
A10/ETH0_RXCTL/3V3: CON0.C23(A10/<ISP_PRELIGHT_TRIG_M0/UART11_RX_M2/I2C9_SCL_M2/SPI1_CSN1_M1/UART10_RTSN_M1/VI_CIF_D4/PDM_CLK1_M3/SAI0_MCLK_M0/SDMMC0_D3_M1/FSPI1_D4_M1/ETH0_RXCTL/GPIO2_C7_d>/3V3) ; off-sheet A10/ETH0_RXCTL/3V3
A11/GPIO2_C4_d/MIPI_DSI_CAP_TS_nINT/3V3: CON0.C57(A11/<PWM2_CH4_M2/I2C8_SCL_M2/UART10_TX_M1/VI_CIF_D7/PDM_SDI0_M3/SAI0_SDI2_M0/SDMMC0_D0_M1/FSPI1_D7_M1/ETH_CLK0_25M_OUT/GPIO2_C4_d>/3V3) ; off-sheet A11/GPIO2_C4_d/MIPI_DSI_CAP_TS_nINT/3V3
A13/MIPI_DPHY_CSI2_RX_D0P: CON0.C30(A13/<MIPI_DPHY_CSI2_RX_D0P>) ; off-sheet A13/MIPI_DPHY_CSI2_RX_D0P
A14/MIPI_DPHY_CSI2_RX_CLKP: CON0.C36(A14/<MIPI_DPHY_CSI2_RX_CLKP>) ; off-sheet A14/MIPI_DPHY_CSI2_RX_CLKP
A16/MIPI_DPHY_CSI2_RX_D2P: CON0.C42(A16/<MIPI_DPHY_CSI2_RX_D2P/MIPI_DPHY_CSI3_RX_D0P>) ; off-sheet A16/MIPI_DPHY_CSI2_RX_D2P
A17/MIPI_DPHY_CSI2_RX_D3P: CON0.C60(A17/<MIPI_DPHY_CSI2_RX_D3P/MIPI_DPHY_CSI3_RX_D1P>) ; off-sheet A17/MIPI_DPHY_CSI2_RX_D3P
A19/MIPI_DPHY_CSI0_RX_D0P: CON0.D68(A19/<MIPI_DPHY_CSI0_RX_D0P>) ; off-sheet A19/MIPI_DPHY_CSI0_RX_D0P
A20/MIPI_DPHY_CSI0_RX_CLKP: CON0.D56(A20/<MIPI_DPHY_CSI0_RX_CLKP>) ; off-sheet A20/MIPI_DPHY_CSI0_RX_CLKP
A22/MIPI_DPHY_CSI0_RX_D2P: CON0.D62(A22/<MIPI_DPHY_CSI0_RX_D2P/MIPI_DPHY_CSI1_RX_D0P>) ; off-sheet A22/MIPI_DPHY_CSI0_RX_D2P
A23/MIPI_DPHY_CSI0_RX_D3P: CON0.D50(A23/<MIPI_DPHY_CSI0_RX_D3P/MIPI_DPHY_CSI1_RX_D1P>) ; off-sheet A23/MIPI_DPHY_CSI0_RX_D3P
A25/USB_DRD0_DM: CON0.D65(A25/<USB_DRD0_DM>) ; off-sheet A25/USB_DRD0_DM
A26/USB_DRD1_DM: CON0.D57(A26/<USB_DRD1_DM>) ; off-sheet A26/USB_DRD1_DM
A28/USB_DRD1_ID/1V8: CON0.D55(A28/<USB_DRD1_ID>/1V8) R602.1 TP23.1 ; off-sheet A28/USB_DRD1_ID/1V8
AA32/UART1_TX_M0/3V3: CON0.B16(AA32/<PWM1_CH4_M0/I2C2_SCL_M0/UART1_TX_M0/NPU_AVS/GPIO0_B7_d>/3V3) ; off-sheet AA32/UART1_TX_M0/3V3
AB32/UART4_RX_M2/3V3: CON0.B14(AB32/<PWM1_CH1_M0/I2C1_SDA_M1/UART4_RX_M2/REF_CLK2_OUT/GPIO0_B5_d>/3V3) ; off-sheet AB32/UART4_RX_M2/3V3
AB33/GPIO0_B6_d/LED1/3V3: CON0.B12(AB33/<PWM1_CH2_M0/SDMMC1_DETN_M1/SDMMC0_PWREN_M0/HDMI_TX_HPDIN_M1/EDP_TX_HPDIN_M1/GPIO0_B6_d>/3V3) ; off-sheet AB33/GPIO0_B6_d/LED1/3V3
AC32/DSMC_DATA2/3V3: CON0.B13(AC32/<SATA0_CPPOD_M1/SPI1_CLK_M2/UART8_RTSN_M0/VO_EBC_SDDO4/VO_LCDC_D4/DSMC_DATA2/GPIO3_C7_d>/3V3) ; off-sheet AC32/DSMC_DATA2/3V3
AC33/UART4_TX_M2/3V3: CON0.B10(AC33/<PWM1_CH0_M0/I2C1_SCL_M1/UART4_TX_M2/REF_CLK1_OUT/GPIO0_B4_d>/3V3) ; off-sheet AC33/UART4_TX_M2/3V3
AD32/SPI4_MISO_M1/3V3: CON0.B11(AD32/<CAN3_RX_M2/PWM2_CH0_M2/I2C9_SCL_M3/SPI4_MISO_M1/UART4_RTSN_M0/SAI2_SCLK_M1/VO_EBC_SDDO9/VO_LCDC_D9/DSMC_INT1/ETH1_TXD3_M0/GPIO3_C2_d>/3V3) ; off-sheet AD32/SPI4_MISO_M1/3V3
AE32/SPI4_MOSI_M1/3V3: CON0.B7(AE32/<CAN3_TX_M2/PWM2_CH1_M2/I2C9_SDA_M3/SPI4_MOSI_M1/UART4_CTSN_M0/SAI2_LRCK_M1/VO_EBC_SDDO8/VO_LCDC_D8/DSMC_INT3/ETH1_TXD2_M0/GPIO3_C3_d>/3V3) ; off-sheet AE32/SPI4_MOSI_M1/3V3
AE33/DSMC_DATA9/3V3: CON0.B23(AE33/<PWM1_CH4_M3/UART3_RTSN_M1/SPDIF_RX0_M3/VO_EBC_SDDO15/VO_LCDC_D15/DSMC_DATA9/ETH1_TXD1_M0/GPIO3_B4_d>/3V3) ; off-sheet AE33/DSMC_DATA9/3V3
AF32/DSMC_CSN0/3V3: CON0.B31(AF32/<PWM2_CH5_M3/SPI3_CSN1_M1/UART2_CTSN_M2/SAI2_SDO_M1/VO_EBC_SDDO0/VO_LCDC_D0/DSMC_CSN0/ETH1_RXD2_M0/GPIO3_D3_z>/3V3) ; off-sheet AF32/DSMC_CSN0/3V3
AF33/SPI4_CSN1_M1/3V3: CON0.B25(AF33/<PWM2_CH4_M3/SPI4_CSN1_M1/UART2_RTSN_M2/SAI2_SDI_M1/VO_EBC_SDDO1/VO_LCDC_D1/DSMC_CSN3/ETH1_RXD3_M0/GPIO3_D2_z>/3V3) ; off-sheet AF33/SPI4_CSN1_M1/3V3
AG32/DSMC_DATA12/3V3: CON0.B35(AG32/<PWM1_CH3_M3/SPI4_CSN0_M1/UART10_TX_M0/PDM_CLK0_M4/VO_EBC_SDCE2/VO_LCDC_D18/DSMC_DATA12/ETH1_RXD1_M0/GPIO3_B1_d>/3V3) ; off-sheet AG32/DSMC_DATA12/3V3
AH32/DSMC_DATA7/3V3: CON0.B37(AH32/<CAN2_TX_M2/I2C4_SCL_M3/UART9_RTSN_M1/UART2_TX_M2/SAI1_SDO3_M1/VO_EBC_SDDO11/VO_LCDC_D11/DSMC_DATA7/ETH1_PPSCLK_M0/GPIO3_C0_d>/3V3) ; off-sheet AH32/DSMC_DATA7/3V3
AH33/DSMC_DATA5/3V3: CON0.B39(AH33/<SATA0_MPSWIT_M1/CAN0_TX_M3/I2C5_SCL_M3/SPI2_CSN0_M2/UART4_TX_M0/SAI2_MCLK_M1/VO_EBC_SDDO7/VO_LCDC_D7/DSMC_DATA5/GPIO3_C4_d>/3V3) ; off-sheet AH33/DSMC_DATA5/3V3
AJ32/DSMC_DATA4/3V3: CON0.B29(AJ32/<PWM2_CH2_M3/SPI1_MISO_M2/UART8_RX_M0/VO_EBC_SDDO6/VO_LCDC_D6/DSMC_DATA4/GPIO3_C5_d>/3V3) ; off-sheet AJ32/DSMC_DATA4/3V3
AJ33/DSMC_DATA3/3V3: CON0.B33(AJ33/<SPI1_MOSI_M2/UART8_TX_M0/VO_EBC_SDDO5/VO_LCDC_D5/DSMC_DATA3/GPIO3_C6_d>/3V3) ; off-sheet AJ33/DSMC_DATA3/3V3
AK32/DSMC_DQS0/3V3: CON0.B47(AK32/<CAN2_RX_M2/I2C4_SDA_M3/UART9_CTSN_M1/UART2_RX_M2/SAI1_SDI0_M1/VO_EBC_SDDO12/VO_LCDC_D12/DSMC_DQS0/ETH1_PPSTRIG_M0/GPIO3_B7_d>/3V3) ; off-sheet AK32/DSMC_DQS0/3V3
AL32/DSMC_DATA0/3V3: CON0.B49(AL32/<I2C3_SCL_M2/SPI3_CLK_M1/UART5_RX_M0/SAI1_SDI1_M1/VO_EBC_SDLE/VO_LCDC_DEN/DSMC_DATA0/GPIO3_D4_d>/3V3) ; off-sheet AL32/DSMC_DATA0/3V3
AL33/DSMC_DATA6/3V3: CON0.B51(AL33/<CAN0_RX_M3/I2C5_SDA_M3/SPI2_MISO_M2/UART4_RX_M0/SAI1_SDO2_M1/VO_EBC_SDDO10/VO_LCDC_D10/DSMC_DATA6/ETH1_PTP_REFCLK_M0/GPIO3_C1_d>/3V3) ; off-sheet AL33/DSMC_DATA6/3V3
AM32/DSMC_RESETN/3V3: CON0.B55(AM32/<SATA1_MPSWIT_M1/PWM2_CH7_M2/UART5_RTSN_M0/SAI1_SDO1_M1/VO_EBC_SDOE/VO_LCDC_CLK/DSMC_RESETN/CAM_CLK0_OUT_M0/GPIO3_D7_d>/3V3) ; off-sheet AM32/DSMC_RESETN/3V3
AM33/DSMC_CLKN/3V3: R508.1 ; off-sheet AM33/DSMC_CLKN/3V3
AN32/CAN1_RX_M1/3V3: CON0.A29(AN32/<CAN1_RX_M1/PWM2_CH3_M1/I2C6_SDA_M3/SPI4_CLK_M0/UART9_RTSN_M0/VO_EBC_SDDO23/GPIO4_B7_d>/3V3) ; off-sheet AN32/CAN1_RX_M1/3V3
AP32/GPIO4_B5_d/LED2/3V3: CON0.A27(AP32/<ISP_FLASH_TRIGOUT_M1/PWM2_CH5_M1/I2C7_SDA_M3/SPI4_MOSI_M0/UART9_RX_M0/VO_EBC_SDDO21/VP0_SYNC_OUT/SATA30_PORT0_ACTLED_M1/GPIO4_B5_d>/3V3) ; off-sheet AP32/GPIO4_B5_d/LED2/3V3
AP33/CAN1_TX_M1/3V3: CON0.A31(AP33/<PCIE1_CLKREQN_M3/CAN1_TX_M1/PWM2_CH2_M1/I2C6_SCL_M3/SPI4_MISO_M0/UART9_CTSN_M0/VO_EBC_SDDO22/VP1_SYNC_OUT/SATA30_PORT1_ACTLED_M1/GPIO4_B6_d>/3V3) ; off-sheet AP33/CAN1_TX_M1/3V3
AR13/ETH1_RXD3_M1/1V8: CON0.A24(AR13/<PWM1_CH1_M1/I2C9_SCL_M1/SPI1_MOSI_M0/SAI4_LRCK_M1/SDMMC1_D1/ETH1_RXD3_M1/GPIO1_B5_d>/1V8) ; off-sheet AR13/ETH1_RXD3_M1/1V8
AR14/ETH1_RXD2_M1/1V8: CON0.A22(AR14/<PCIE1_CLKREQN_M1/PWM1_CH0_M1/I2C9_SDA_M1/SPI1_CLK_M0/SAI4_MCLK_M1/SDMMC1_D0/ETH1_RXD2_M1/GPIO1_B4_d>/1V8) ; off-sheet AR14/ETH1_RXD2_M1/1V8
AR15/ETH1_TXCLK_M1/1V8: C436.1 CON0.A34(AR15/<UART3_RX_M2/PDM_CLK0_M2/SDMMC1_CLK/ETH1_TXCLK_M1/GPIO1_C1_d>/1V8) ; off-sheet AR15/ETH1_TXCLK_M1/1V8
AR16/ETH1_TXD3_M1/1V8: R496.2 ; off-sheet AR16/ETH1_TXD3_M1/1V8
AR17/CAN2_TX_M1/1V8: CON0.A32(AR17/<SATA0_CPDET_M0/CAN2_TX_M1/I2C6_SDA_M1/UART4_CTSN_M1/SDMMC1_DETN_M0/ETH1_PPSTRIG_M1/GPIO1_C3_d>/1V8) ; off-sheet AR17/CAN2_TX_M1/1V8
AR18/CAN3_TX_M0/1V8: CON0.A1(AR18/<CLK1_32K_OUT/CAN3_TX_M0/I2C5_SDA_M1/SPI2_CLK_M1/UART7_CTSN_M0/PDM_CLK1_M2/SPDIF_TX0_M1/ETH_CLK1_25M_OUT_M1/GPIO1_D5_d>/1V8) ; off-sheet AR18/CAN3_TX_M0/1V8
AR20/HDMI_TX_D3N: CON0.A41(AR20/<HDMI_TX_D3N/EDP_TX_D3N>) ; off-sheet AR20/HDMI_TX_D3N
AR21/HDMI_TX_D0P: CON0.A49(AR21/<HDMI_TX_D0P/EDP_TX_D0P>) ; off-sheet AR21/HDMI_TX_D0P
AR23/HDMI_TX_D1N: CON0.A53(AR23/<HDMI_TX_D1N/EDP_TX_D1N>) ; off-sheet AR23/HDMI_TX_D1N
AR24/HDMI_TX_D2P: CON0.A61(AR24/<HDMI_TX_D2P/EDP_TX_D2P>) ; off-sheet AR24/HDMI_TX_D2P
AR26/MIPI_DPHY_DSI_TX_D1N: CON0.B62(AR26/<MIPI_DPHY_DSI_TX_D1N>) ; off-sheet AR26/MIPI_DPHY_DSI_TX_D1N
AR27/MIPI_DPHY_DSI_TX_CLKN: CON0.B56(AR27/<MIPI_DPHY_DSI_TX_CLKN>) ; off-sheet AR27/MIPI_DPHY_DSI_TX_CLKN
AR29/MIPI_DPHY_DSI_TX_D2N: CON0.B50(AR29/<MIPI_DPHY_DSI_TX_D2N>) ; off-sheet AR29/MIPI_DPHY_DSI_TX_D2N
AR30/MIPI_DPHY_DSI_TX_D3N: CON0.B44(AR30/<MIPI_DPHY_DSI_TX_D3N>) ; off-sheet AR30/MIPI_DPHY_DSI_TX_D3N
AR32/HDMI_TX_SDA_M0/3V3: CON0.A35(AR32/<CAN0_RX_M1/HDMI_TX_SDA_M0/PWM2_CH1_M1/I2C2_SDA_M3/UART6_CTSN_M1/VO_EBC_SDDO19/DSM_AUD_RN_M1/SAI3_SCLK_M2/GPIO4_B3_d>/3V3) ; off-sheet AR32/HDMI_TX_SDA_M0/3V3
AR33/GPIO4_B4_d/HP_DET_L/XL9555_INT1/3V3: CON0.A33(AR33/<ISP_PRELIGHT_TRIG_M1/PWM2_CH6_M1/I2C7_SCL_M3/SPI4_CSN0_M0/UART9_TX_M0/VO_EBC_SDDO20/SAI3_SDO_M2/GPIO4_B4_d>/3V3) ; off-sheet AR33/GPIO4_B4_d/HP_DET_L/XL9555_INT1/3V3
AT14/ETH1_RXCLK_M1/1V8: CON0.A26(AT14/<PCIE0_CLKREQN_M1/SPI1_MISO_M0/UART3_CTSN_M2/SAI4_SDI_M1/SDMMC1_D2/ETH1_RXCLK_M1/GPIO1_B6_d>/1V8) ; off-sheet AT14/ETH1_RXCLK_M1/1V8
AT15/ETH1_TXD2_M1/1V8: R495.2 ; off-sheet AT15/ETH1_TXD2_M1/1V8
AT17/ETH1_TXD0_M1/1V8: R502.2 ; off-sheet AT17/ETH1_TXD0_M1/1V8
AT18/ETH1_TXD1_M1/1V8: R500.2 ; off-sheet AT18/ETH1_TXD1_M1/1V8
AT20/HDMI_TX_D3P: CON0.A43(AT20/<HDMI_TX_D3P/EDP_TX_D3P>) ; off-sheet AT20/HDMI_TX_D3P
AT21/HDMI_TX_D0N: CON0.A47(AT21/<HDMI_TX_D0N/EDP_TX_D0N>) ; off-sheet AT21/HDMI_TX_D0N
AT23/HDMI_TX_D1P: CON0.A55(AT23/<HDMI_TX_D1P/EDP_TX_D1P>) ; off-sheet AT23/HDMI_TX_D1P
AT24/HDMI_TX_D2N: CON0.A59(AT24/<HDMI_TX_D2N/EDP_TX_D2N>) ; off-sheet AT24/HDMI_TX_D2N
AT26/MIPI_DPHY_DSI_TX_D1P: CON0.B60(AT26/<MIPI_DPHY_DSI_TX_D1P>) ; off-sheet AT26/MIPI_DPHY_DSI_TX_D1P
AT27/MIPI_DPHY_DSI_TX_CLKP: CON0.B54(AT27/<MIPI_DPHY_DSI_TX_CLKP>) ; off-sheet AT27/MIPI_DPHY_DSI_TX_CLKP
AT29/MIPI_DPHY_DSI_TX_D2P: CON0.B48(AT29/<MIPI_DPHY_DSI_TX_D2P>) ; off-sheet AT29/MIPI_DPHY_DSI_TX_D2P
AT30/MIPI_DPHY_DSI_TX_D3P: CON0.B42(AT30/<MIPI_DPHY_DSI_TX_D3P>) ; off-sheet AT30/MIPI_DPHY_DSI_TX_D3P
AT32/HDMI_TX_SCL_M0/3V3: CON0.A37(AT32/<CAN0_TX_M1/HDMI_TX_SCL_M0/PWM2_CH0_M1/I2C2_SCL_M3/UART6_RTSN_M1/VO_EBC_SDDO18/DSM_AUD_RP_M1/SAI3_LRCK_M2/GPIO4_B2_d>/3V3) ; off-sheet AT32/HDMI_TX_SCL_M0/3V3
B3/GPIO2_B2_d/MIPI_DSI_BL_PWM/3V3: CON0.C43(B3/<I2C4_SCL_M1/SPI3_MOSI_M2/UART9_TX_M2/PDM_CLK0_M1/SAI0_SCLK_M2/VI_CIF_D15/UART6_RTSN_M0/GPIO2_B2_d>/3V3) ; off-sheet B3/GPIO2_B2_d/MIPI_DSI_BL_PWM/3V3
B4/UART2_TX_M1/3V3: CON0.C45(B4/<PWM2_CH6_M0/SPI3_CLK_M2/UART2_TX_M1/SAI0_SDI0_M2/SAI1_SDO0_M0/VI_CIF_D12/ETH0_PTP_REFCLK/GPIO2_B5_d>/3V3) ; off-sheet B4/UART2_TX_M1/3V3
B5/ETH0_TXD3/3V3: R498.1 ; off-sheet B5/ETH0_TXD3/3V3
B7/ETH0_RXCLK/3V3: CON0.C9(B7/<CAN1_RX_M3/PWM2_CH3_M2/I2C4_SDA_M2/SPI3_CSN0_M0/UART3_RTSN_M0/VI_CIF_CLKI/SPDIF_TX0_M2/FSPI1_RST/FSPI1_CSN1_M1/ETH0_RXCLK/GPIO2_D7_z>/3V3) ; off-sheet B7/ETH0_RXCLK/3V3
B8/ETH0_TXCLK/3V3: C437.1 CON0.C25(B8/<MIPI_TE_M1/CAN1_TX_M3/PWM2_CH2_M2/I2C4_SCL_M2/SPI3_MISO_M0/UART3_CTSN_M0/VI_CIF_CLKO/SPDIF_RX0_M2/SAI0_SDI3_M0/CAM_CLK2_OUT_M1/FSPI1_CSN0_M1/ETH0_TXCLK/GPIO2_D6_z>/3V3) ; off-sheet B8/ETH0_TXCLK/3V3
B9/ETH0_MDC/3V3: R506.2 ; off-sheet B9/ETH0_MDC/3V3
B10/ETH0_MDIO/3V3: CON0.C12(B10/<PWM2_CH5_M2/I2C8_SDA_M2/UART10_RX_M1/VI_CIF_D6/PDM_CLK0_M3/SAI0_SDI1_M0/SDMMC0_D1_M1/FSPI1_D6_M1/ETH0_MDIO/GPIO2_C5_d>/3V3) ; off-sheet B10/ETH0_MDIO/3V3
B11/SDMMC0_D2_M0/JTAG_TCK_M0/3V3: CON0.C59(B11/<CAN0_RX_M0/JTAG_TCK_M0/SPI0_CSN1_M1/UART5_RTSN_M2/SAI3_LRCK_M1/DSM_AUD_RP_M0/SDMMC0_D2_M0/FSPI1_D2_M0/GPIO2_A2_d>/3V3) ; off-sheet B11/SDMMC0_D2_M0/JTAG_TCK_M0/3V3
B13/MIPI_DPHY_CSI2_RX_D0N: CON0.C32(B13/<MIPI_DPHY_CSI2_RX_D0N>) ; off-sheet B13/MIPI_DPHY_CSI2_RX_D0N
B14/MIPI_DPHY_CSI2_RX_CLKN: CON0.C38(B14/<MIPI_DPHY_CSI2_RX_CLKN>) ; off-sheet B14/MIPI_DPHY_CSI2_RX_CLKN
B16/MIPI_DPHY_CSI2_RX_D2N: CON0.C44(B16/<MIPI_DPHY_CSI2_RX_D2N/MIPI_DPHY_CSI3_RX_D0N>) ; off-sheet B16/MIPI_DPHY_CSI2_RX_D2N
B17/MIPI_DPHY_CSI2_RX_D3N: CON0.C62(B17/<MIPI_DPHY_CSI2_RX_D3N/MIPI_DPHY_CSI3_RX_D1N>) ; off-sheet B17/MIPI_DPHY_CSI2_RX_D3N
B19/MIPI_DPHY_CSI0_RX_D0N: CON0.D66(B19/<MIPI_DPHY_CSI0_RX_D0N>) ; off-sheet B19/MIPI_DPHY_CSI0_RX_D0N
B20/MIPI_DPHY_CSI0_RX_CLKN: CON0.D54(B20/<MIPI_DPHY_CSI0_RX_CLKN>) ; off-sheet B20/MIPI_DPHY_CSI0_RX_CLKN
B22/MIPI_DPHY_CSI0_RX_D2N: CON0.D60(B22/<MIPI_DPHY_CSI0_RX_D2N/MIPI_DPHY_CSI1_RX_D0N>) ; off-sheet B22/MIPI_DPHY_CSI0_RX_D2N
B23/MIPI_DPHY_CSI0_RX_D3N: CON0.D48(B23/<MIPI_DPHY_CSI0_RX_D3N/MIPI_DPHY_CSI1_RX_D1N>) ; off-sheet B23/MIPI_DPHY_CSI0_RX_D3N
B25/USB_DRD0_DP: CON0.D67(B25/<USB_DRD0_DP>) ; off-sheet B25/USB_DRD0_DP
B26/USB_DRD1_DP: CON0.D59(B26/<USB_DRD1_DP>) ; off-sheet B26/USB_DRD1_DP
B28/USB_DRD1_VBUSDET/3V3: CON0.D61(B28/<USB_DRD1_VBUSDET>/3V3) ; off-sheet B28/USB_DRD1_VBUSDET/3V3
D32/USB_DRD0_SSRXN: C440.1 ; off-sheet D32/USB_DRD0_SSRXN
D33/USB_DRD0_SSRXP: C441.1 ; off-sheet D33/USB_DRD0_SSRXP
E32/USB_DRD0_SSTXP: CON0.D37(E32/<PCIE0_TXP_M0/SATA0_TXP_M0/USB_DRD0_SSTXP>) ; off-sheet E32/USB_DRD0_SSTXP
E33/USB_DRD0_SSTXN: CON0.D35(E33/<PCIE0_TXN_M0/SATA0_TXN_M0/USB_DRD0_SSTXN>) ; off-sheet E33/USB_DRD0_SSTXN
G32/USB_DRD1_SSTXP: CON0.D31(G32/<PCIE0_TXP_M1/SATA0_TXP_M1/USB_DRD1_SSTXP>) ; off-sheet G32/USB_DRD1_SSTXP
G33/USB_DRD1_SSTXN: CON0.D29(G33/<PCIE0_TXN_M1/SATA0_TXN_M1/USB_DRD1_SSTXN>) ; off-sheet G33/USB_DRD1_SSTXN
H32/USB_DRD1_SSRXP: C439.1 ; off-sheet H32/USB_DRD1_SSRXP
H33/USB_DRD1_SSRXN: C438.1 ; off-sheet H33/USB_DRD1_SSRXN
K32/PCIE1_RXN: CON0.D30(K32/<PCIE1_RXN/SATA1_RXN>) ; off-sheet K32/PCIE1_RXN
K33/PCIE1_RXP: CON0.D32(K33/<PCIE1_RXP/SATA1_RXP>) ; off-sheet K33/PCIE1_RXP
L32/PCIE1_TXN: CON0.D24(L32/<PCIE1_TXN/SATA1_TXN>) ; off-sheet L32/PCIE1_TXN
L33/PCIE1_TXP: CON0.D26(L33/<PCIE1_TXP/SATA1_TXP>) ; off-sheet L33/PCIE1_TXP
P32/NPOR_u/PU/1V8: CON0.D2(P32/<NPOR_u>/1V8) ; off-sheet P32/NPOR_u/PU/1V8
RK806S_PWRON/PU/5V: CON0.D15(RK806S_PWRON) ; off-sheet RK806S_PWRON/PU/5V
T32/I2C1_SCL_M0/1V8: CON0.D6(T32/<I2C1_SCL_M0/SPI2_CLK_M0/GPIO0_B2_z>/1V8) R621.2 U2.4(A2) ; off-sheet T32/I2C1_SCL_M0/1V8
T32/I2C1_SCL_M0/3V3: R4.2 U2.1(B2) ; off-sheet T32/I2C1_SCL_M0/3V3
T33/SDMMC0_DETN_M0/1V8: CON0.D8(T33/<SPI2_CSN1_M0/SDMMC0_DETN_M0/GPIO0_A7_u>/1V8) ; off-sheet T33/SDMMC0_DETN_M0/1V8
U33/UART0_TX_M0/3V3: CON0.B4(U33/<JTAG_TCK_M1/UART0_TX_M0/GPIO0_D4_u>/3V3) ; off-sheet U33/UART0_TX_M0/3V3
V32/UART0_RX_M0/3V3: CON0.B6(V32/<JTAG_TMS_M1/UART0_RX_M0/GPIO0_D5_u>/3V3) ; off-sheet V32/UART0_RX_M0/3V3
W32/UART8_RX_M1/3V3: CON0.B8(W32/<I3C_SDA_M0/UART8_RX_M1/GPIO0_C2_d>/3V3) ; off-sheet W32/UART8_RX_M1/3V3
Y32/UART1_RX_M0/3V3: CON0.B20(Y32/<PWM1_CH3_M0/I2C2_SDA_M0/UART1_RX_M0/CPULIT_AVS/GPIO0_C0_d>/3V3) ; off-sheet Y32/UART1_RX_M0/3V3
Y33/UART8_TX_M1/3V3: CON0.B18(Y33/<I3C_SCL_M0/UART8_TX_M1/GPIO0_C1_d>/3V3) ; off-sheet Y33/UART8_TX_M1/3V3
NetC438_2: C438.2 CON0.D23(H33/<PCIE0_RXN_M1/SATA0_RXN_M1/USB_DRD1_SSRXN>)
NetC439_2: C439.2 CON0.D25(H32/<PCIE0_RXP_M1/SATA0_RXP_M1/USB_DRD1_SSRXP>)
NetC440_2: C440.2 CON0.D41(D32/<PCIE0_RXN_M0/SATA0_RXN_M0/USB_DRD0_SSRXN>)
NetC441_2: C441.2 CON0.D43(D33/<PCIE0_RXP_M0/SATA0_RXP_M0/USB_DRD0_SSRXP>)
NetCON0_A10: CON0.A10(1AE7/<HDMI_TX_SCL_M1/I2C8_SCL_M1/SPI2_CSN0_M1/UART2_TX_M0/PDM_SDI0_M2/ETH1_TXCTL_M1/GPIO1_C6_d>/1V8) R501.1
NetCON0_A12: CON0.A12(1AD9/<SATA1_CPDET_M0/PWM1_CH3_M1/I3C_SCL_M1/SAI2_LRCK_M0/ETH1_MDC_M1/GPIO1_D2_d>/1V8) R505.1
NetCON0_A30: CON0.A30(AT15/<SPI1_CSN0_M0/UART3_RTSN_M2/SAI4_SDO_M1/SDMMC1_D3/ETH1_TXD2_M1/GPIO1_B7_d>/1V8) R495.1
NetCON0_A36: CON0.A36(AR16/<PWM0_CH0_M1/SPI1_CSN1_M0/UART3_TX_M2/PDM_SDI2_M2/SAI4_SCLK_M1/SDMMC1_CMD/ETH1_TXD3_M1/GPIO1_C0_d>/1V8) R496.1
NetCON0_A38: CON0.A38(AT17/<SPI2_MOSI_M1/UART4_TX_M1/UART2_RTSN_M0/ETH1_TXD0_M1/GPIO1_C4_d>/1V8) R502.1
NetCON0_A40: CON0.A40(AT18/<SPI2_MISO_M1/UART4_RX_M1/UART2_CTSN_M0/ETH1_TXD1_M1/GPIO1_C5_d>/1V8) R500.1
NetCON0_B15: CON0.B15(1V20/<SPI4_CLK_M1/VO_EBC_SDDO2/VO_LCDC_D2/DSMC_CSN2/ETH1_RXCLK_M0/GPIO3_D1_z>/3V3) R510.2
NetCON0_B53: CON0.B53(AM33/<PWM2_CH6_M2/SPI3_MOSI_M1/UART5_CTSN_M0/SAI1_SDI3_M1/VO_EBC_SDCLK/VO_LCDC_VSYNC/DSMC_CLKN/GPIO3_D6_d>/3V3) R508.2
NetCON0_B61: CON0.B61(1AB20/<I2C3_SDA_M2/SPI3_MISO_M1/UART5_TX_M0/SAI1_SDI2_M1/VO_EBC_GDCLK/VO_LCDC_HSYNC/DSMC_CLKP/GPIO3_D5_d>/3V3) R509.2
NetCON0_C5: CON0.C5(A5/<CAN1_RX_M2/MIPI_TE_M0/I2C3_SDA_M0/UART5_RX_M1/SAI0_SDI3_M2/SPDIF_RX0_M0/ETH0_TXD2/GPIO2_C2_d>/3V3) R499.2
NetCON0_C7: CON0.C7(B5/<CAN1_TX_M2/PCIE0_CLKREQN_M2/I2C3_SCL_M0/UART5_TX_M1/SPDIF_TX0_M0/ETH0_TXD3/GPIO2_C3_d>/3V3) R498.2
NetCON0_C14: CON0.C14(B9/<UART11_TX_M2/I2C9_SDA_M2/SPI3_CSN1_M0/UART10_CTSN_M1/VI_CIF_D5/PDM_SDI1_M3/SAI0_SDO1_M0/SDMMC0_D2_M1/FSPI1_D5_M1/ETH0_MDC/GPIO2_C6_d>/3V3) R506.1
NetCON0_C20: CON0.C20(1A6/<CAN3_TX_M1/I2C5_SCL_M2/SPI3_CLK_M0/UART3_TX_M0/VI_CIF_HREF/SAI0_SDO2_M0/CAM_CLK0_OUT_M1/FSPI1_DQS_M1/ETH0_TXD0/GPIO2_D4_d>/3V3) R493.1
NetCON0_C22: CON0.C22(1B6/<CAN3_RX_M1/I2C5_SDA_M2/SPI3_MOSI_M0/UART3_RX_M0/VI_CIF_VSYNC/SPDIF_TX1_M2/SAI0_SDO3_M0/CAM_CLK1_OUT_M1/FSPI1_CLK_M1/ETH0_TXD1/GPIO2_D5_d>/3V3) R497.2
NetCON0_C24: CON0.C24(1C6/<PWM1_CH4_M2/I2C6_SDA_M2/SPI1_CLK_M1/UART1_RX_M1/VI_CIF_D0/SAI0_SDI0_M0/SDMMC0_DETN_M1/FSPI1_D0_M1/ETH0_TXCTL/GPIO2_D3_d>/3V3) R494.1
NetCON0_D36: CON0.D36(1F22/<PCIE0_REFCLKN_M1>) TP20.1
NetCON0_D38: CON0.D38(1F21/<PCIE0_REFCLKP_M1>) TP21.1
NetCON0_D47: CON0.D47(1D22/<PCIE0_REFCLKN_M0>) TP18.1
NetCON0_D49: CON0.D49(1D21/<PCIE0_REFCLKP_M0>) TP19.1
NetR9_2: R9.2 U1.6(OE)
NetR609_2: R609.2 U2.6(OE)

Not connected (* = marked no-connect by the designer): CON0 A44(NC1)* A46(NC2)* A48(NC3)* A50(NC4)* A52(NC5)* A54(NC6)* A56(NC7)* A58(NC8)* A60(NC9)* A64(NC10)* A66(NC11)* A68(NC12)* D13(RK806S_PWR_CTRL2/1V8)*

### Notes on the sheet
- SOM CONNECTOR CON0
- IO
- SARADC
- Layout Note:
  As wide as possible
- Layout Note:
  50±10% ohm Single-ended
  impedance
- Layout Note:
  50 ohm Difference impedance
- ETH1
- Layout Note:
  50±10% ohm Single-ended
  impedance
  Should be routed in Groupand
  need to the samelength with
  ±50mil
- HDMI TX
- Layout Note:
  100 ohm Difference
  impedance
  Should be routed in
  Groupand need to the
  samelength with ±5mil
- Place close to the CON0A.
- Place close to the CON0C.
- ETH0
- Layout Note:
  50±10% ohm Single-ended
  impedance
  Should be routed in
  Groupand need to the
  samelength with ±50mil
- MIPI RX1
- SDMMC
- Layout Note:
  100 ohm Difference impedance
  Should be routed in Groupand
  need to the samelength with
  ±5mil
- Layout Note:
  50±10% ohm Single-ended
  impedance
  Should be routed in
  Groupand need to the
  samelength with ±25mil
- DSMC
- Layout Note:
  50±10% ohm Single-ended impedance
  Should be routed in Groupand need
  to the samelength with ±50mil
- MIPI TX
- (near CON0) Imax=3A
- (near CON0) RK806S_PWR_CTRL2/1V8: Asserts high during system sleep or
  shutdown; drives low in normal operation.
- PMIO0
- Imax=0.5A
- Imax=0.1A
- A1.1-000
- USB3.0
- PCIe2.1
- Layout Note:
  90 ohm Difference impedance
  Should be routed in Groupand
  need to the samelength with
  ±5mil
  50±10% ohm Single-ended
  impedance
- Layout Note:
  100±10% ohm Difference impedance
- USB2.0
- MIPI RX0
- Layout Note:
  90±10% ohm Difference impedance
  Should be routed in Groupand
  need to the samelength with
  ±5mil
- Layout Note:
  100 ohm Difference impedance
  Should be routed in Groupand need
  to the samelength with ±5mil
- Power Net Description
- NET
- VOLTAGE
- DIRECTION
- VDD_5V_SOM
- 5V
- INPUT
- VDD_3V3_SOM_OUTPUT
- VDD_SD_ADJ
- 3.3V(Default)
  1.8V(SD3.0)
- 3.3V
- OUTPUT
- (in symbol Tronlong_TITTLE_20211115) Title; Size; Document Number; Date:; Sheet; of
- (in symbol TXS0102DCUR_0) VCCA＜VCCB

### Library data of the parts
*#1 = Tronlong_TITTLE_20211115: RevCode: A?; Page Create Date: March  8, 1995; Page Modify Date: *
C1 = CAP NP_Dup2: 贴片陶瓷电容,22uF,20%,25V,X5R; Manufacturer: 广东风华高新科技股份有限公司（FH）; Manufacturer PartNumber: 0805X226M250NT; Manufacturer Character: 中国大陆; ERP Number: 005.0001.0001.00524; As-Welded: /; Operation Temperature（℃）: -55~+85(Ta); Eco-Label: ROHS; Part Status: 优选; Temperature: -55~125℃; PCB Footprint: C0805
C2 = CAP NP_Dup2: 贴片陶瓷电容,22uF,20%,25V,X5R; Manufacturer: 广东风华高新科技股份有限公司（FH）; Manufacturer PartNumber: 0805X226M250NT; Manufacturer Character: 中国大陆; Eco-Label: ROHS; Operation Temperature（℃）: -55~+85(Ta); As-Welded: /; ERP Number: 005.0001.0001.00524; Part Status: 优选; Temperature: -55~125℃; PCB Footprint: C0805
C3 C13 = CAP NP_Dup2: 贴片陶瓷电容,100nF,10%,50V,X7R; Manufacturer PartNumber: 0402B104K500NT; Manufacturer: 广东风华高新科技股份有限公司（FH）; Manufacturer Character: 中国大陆; ERP Number: 005.0001.0001.00681; Operation Temperature（℃）: -55~+125(Ta); As-Welded: /; Eco-Label: ROHS; Temperature: -55~125℃; Part Status: 试用; PCB Footprint: C0402
C8 C9 = CAP NP_Dup3: 贴片陶瓷电容,100nF,10%,50V,X7R; Manufacturer Character: 中国大陆; Manufacturer PartNumber: 0402B104K500NT; Manufacturer: 广东风华高新科技股份有限公司（FH）; Eco-Label: ROHS; ERP Number: 005.0001.0001.00681; Operation Temperature（℃）: -55~+125(Ta); As-Welded: /; Part Status: 试用; PCB Footprint: C0402
C10 = CAP NP_Dup3: 贴片陶瓷电容,100nF,10%,50V,X7R; Manufacturer PartNumber: 0402B104K500NT; Manufacturer: 广东风华高新科技股份有限公司（FH）; Manufacturer Character: 中国大陆; Eco-Label: ROHS; Operation Temperature（℃）: -55~+125(Ta); ERP Number: 005.0001.0001.00681; As-Welded: /; Part Status: 试用; Temperature: -55~155℃; PCB Footprint: C0402
C11 = CAP NP_Dup3: 贴片陶瓷电容,100nF,10%,50V,X7R; Manufacturer: 广东风华高新科技股份有限公司（FH）; Manufacturer PartNumber: 0402B104K500NT; Manufacturer Character: 中国大陆; Eco-Label: ROHS; Operation Temperature（℃）: -55~+125(Ta); ERP Number: 005.0001.0001.00681; As-Welded: /; Part Status: 试用; Temperature: -55~155℃; PCB Footprint: C0402
C12 = CAP NP_Dup2: 贴片陶瓷电容,22uF,20%,25V,X5R; Manufacturer Character: 中国大陆; Manufacturer PartNumber: 0805X226M250NT; Manufacturer: 广东风华高新科技股份有限公司（FH）; Eco-Label: ROHS; Operation Temperature（℃）: -55~+85(Ta); As-Welded: /; ERP Number: 005.0001.0001.00524; Part Status: 优选; Temperature: -55~125℃; PCB Footprint: C0805
C436 C437 = CAP NP_Dup2: 贴片陶瓷电容,22pF,5%,50V,COG; Manufacturer: 广东风华高新科技股份有限公司（FH）; Manufacturer PartNumber: 0402CG220J500NT; Manufacturer Character: 中国大陆; Eco-Label: EXEMPTION; As-Welded: DNP; Operation Temperature（℃）: -55~+125(Ta); ERP Number: 005.0001.0001.00543; Part Status: 优选; PCB Footprint: C0402
C438 C440 = CAP NP_Dup2: 贴片陶瓷电容,100nF,10%,50V,X7R; Manufacturer PartNumber: 0402B104K500NT; Manufacturer Character: 中国大陆; Manufacturer: 广东风华高新科技股份有限公司（FH）; As-Welded: /; Operation Temperature（℃）: -55~+125(Ta); ERP Number: 005.0001.0001.00681; Eco-Label: ROHS; Part Status: 试用; PCB Footprint: C0402
C439 = CAP NP_Dup2: 贴片陶瓷电容,100nF,10%,50V,X7R; Manufacturer: 广东风华高新科技股份有限公司（FH）; Manufacturer PartNumber: 0402B104K500NT; Manufacturer Character: 中国大陆; Eco-Label: ROHS; ERP Number: 005.0001.0001.00681; Operation Temperature（℃）: -55~+125(Ta); As-Welded: /; Part Status: 试用; PCB Footprint: C0402
C441 = CAP NP_Dup2: 贴片陶瓷电容,100nF,10%,50V,X7R; Manufacturer Character: 中国大陆; Manufacturer PartNumber: 0402B104K500NT; Manufacturer: 广东风华高新科技股份有限公司（FH）; As-Welded: /; Operation Temperature（℃）: -55~+125(Ta); ERP Number: 005.0001.0001.00681; Eco-Label: ROHS; Part Status: 试用; PCB Footprint: C0402
R3 R622 R623 = Resistor_Dup4: 贴片电阻,2.2K,±1%,1/16W; Manufacturer Character: 中国大陆; Manufacturer PartNumber: RC-02K2201FT; Manufacturer: 广东风华高新科技股份有限公司（FH）; CLASS: DISCRETE; Eco-Label: ROHS; ERP Number: 005.0001.0002.01317; As-Welded: DNP; Operation Temperature（℃）: -55~+125(Ta); Part Status: 试用; Temperature: -55~155℃; PCB Footprint: R0402
R4 R8 = Resistor_Dup4: 贴片电阻,2.2K,±1%,1/16W; Manufacturer Character: 中国大陆; Manufacturer PartNumber: RC-02K2201FT; Manufacturer: 广东风华高新科技股份有限公司（FH）; CLASS: DISCRETE; As-Welded: DNP; Operation Temperature（℃）: -55~+125(Ta); ERP Number: 005.0001.0002.01317; Eco-Label: ROHS; Temperature: -55~155℃; Part Status: 试用; PCB Footprint: R0402
R7 R620 R621 = Resistor_Dup4: 贴片电阻,2.2K,±1%,1/16W; Manufacturer: 广东风华高新科技股份有限公司（FH）; Manufacturer PartNumber: RC-02K2201FT; Manufacturer Character: 中国大陆; CLASS: DISCRETE; Operation Temperature（℃）: -55~+125(Ta); As-Welded: DNP; ERP Number: 005.0001.0002.01317; Eco-Label: ROHS; Temperature: -55~155℃; Part Status: 试用; PCB Footprint: R0402
R9 R609 = Resistor_Dup4: 贴片电阻,10K,±1%,1/16W; Manufacturer: 广东风华高新科技股份有限公司（FH）; Manufacturer PartNumber: RC-02K1002FT; Manufacturer Character: 中国大陆; CLASS: DISCRETE; Eco-Label: ROHS; ERP Number: 005.0001.0002.01326; As-Welded: /; Operation Temperature（℃）: -55~+125(Ta); Part Status: 优选; PCB Footprint: R0402
R493 R501 R509 = Resistor_Dup3: 贴片电阻,22R,±1%,1/16W; Manufacturer: 广东风华高新科技股份有限公司（FH）; Manufacturer PartNumber: RC-02K22R0FT; Manufacturer Character: 中国大陆; CLASS: DISCRETE; ERP Number: 005.0001.0002.01316; As-Welded: /; Operation Temperature（℃）: -55~+125(Ta); room: RS232; Eco-Label: ROHS; Part Status: 试用; PCB Footprint: R0402
R494 R495 = Resistor_Dup3: 贴片电阻,22R,±1%,1/16W; Manufacturer Character: 中国大陆; Manufacturer PartNumber: RC-02K22R0FT; Manufacturer: 广东风华高新科技股份有限公司（FH）; CLASS: DISCRETE; ERP Number: 005.0001.0002.01316; As-Welded: /; Operation Temperature（℃）: -55~+125(Ta); room: RS232; Eco-Label: ROHS; Part Status: 试用; PCB Footprint: R0402
R496-R498 R502 R506 = Resistor_Dup3: 贴片电阻,22R,±1%,1/16W; Manufacturer Character: 中国大陆; Manufacturer PartNumber: RC-02K22R0FT; Manufacturer: 广东风华高新科技股份有限公司（FH）; CLASS: DISCRETE; Eco-Label: ROHS; room: RS232; Operation Temperature（℃）: -55~+125(Ta); As-Welded: /; ERP Number: 005.0001.0002.01316; Part Status: 试用; PCB Footprint: R0402
R499 R500 R505 R508 R510 = Resistor_Dup3: 贴片电阻,22R,±1%,1/16W; Manufacturer: 广东风华高新科技股份有限公司（FH）; Manufacturer PartNumber: RC-02K22R0FT; Manufacturer Character: 中国大陆; CLASS: DISCRETE; Eco-Label: ROHS; room: RS232; Operation Temperature（℃）: -55~+125(Ta); As-Welded: /; ERP Number: 005.0001.0002.01316; Part Status: 试用; PCB Footprint: R0402
R601 = Resistor_Dup4: 贴片电阻,10K,±1%,1/16W; Manufacturer PartNumber: RC-02K1002FT; Manufacturer: 广东风华高新科技股份有限公司（FH）; Manufacturer Character: 中国大陆; CLASS: DISCRETE; Eco-Label: ROHS; Operation Temperature（℃）: -55~+125(Ta); room: KEY; ERP Number: 005.0001.0002.01326; As-Welded: DNP; Temperature: -55~125℃; Part Status: 优选; PCB Footprint: R0402
R602 = Resistor_Dup4: 贴片电阻,10K,±1%,1/16W; Manufacturer Character: 中国大陆; Manufacturer: 广东风华高新科技股份有限公司（FH）; Manufacturer PartNumber: RC-02K1002FT; CLASS: DISCRETE; As-Welded: DNP; ERP Number: 005.0001.0002.01326; room: KEY; Operation Temperature（℃）: -55~+125(Ta); Eco-Label: ROHS; Part Status: 优选; Temperature: -55~125℃; PCB Footprint: R0402
TP18-TP23 = TP-S40: /; Manufacturer Character: 中国大陆; Characteristic: Test point,diameter=1.0mm; As-Welded: DNP; Manufacturer PartNumber: /; Manufacturer: /; Operation Temperature（℃）: /; PCB Footprint: TP30
U1 = TXS0102DCUR_0: 2位双向电平转换器; Manufacturer: 江苏润石科技有限公司（RUNIC）; Manufacturer Character: 中国大陆; Eco-Label: ROHS; ERP Number: 005.0001.0004.00890; As-Welded: /; Operation Temperature（℃）: -40~+85(Ta); Temperature: -40~85℃; Manufacturer PartNumber: RS0102YVS8; Part Status: 试用; PCB Footprint: SOP8-20-91
U2 = TXS0102DCUR_0: 2位双向电平转换器; Manufacturer: 江苏润石科技有限公司（RUNIC）; Manufacturer Character: 中国大陆; Operation Temperature（℃）: -40~+85(Ta); As-Welded: /; ERP Number: 005.0001.0004.00890; Eco-Label: ROHS; Temperature: -40~85℃; Manufacturer PartNumber: RS0102YVS8; Part Status: 试用; PCB Footprint: SOP8-20-91
CON0 = B2B_SOM-TL3572: PCB Footprint: B2B_SOM-TL3572